# Altium project PrintNC_GRBLHAL_Breakout.PrjPCB (part 1 of 2)
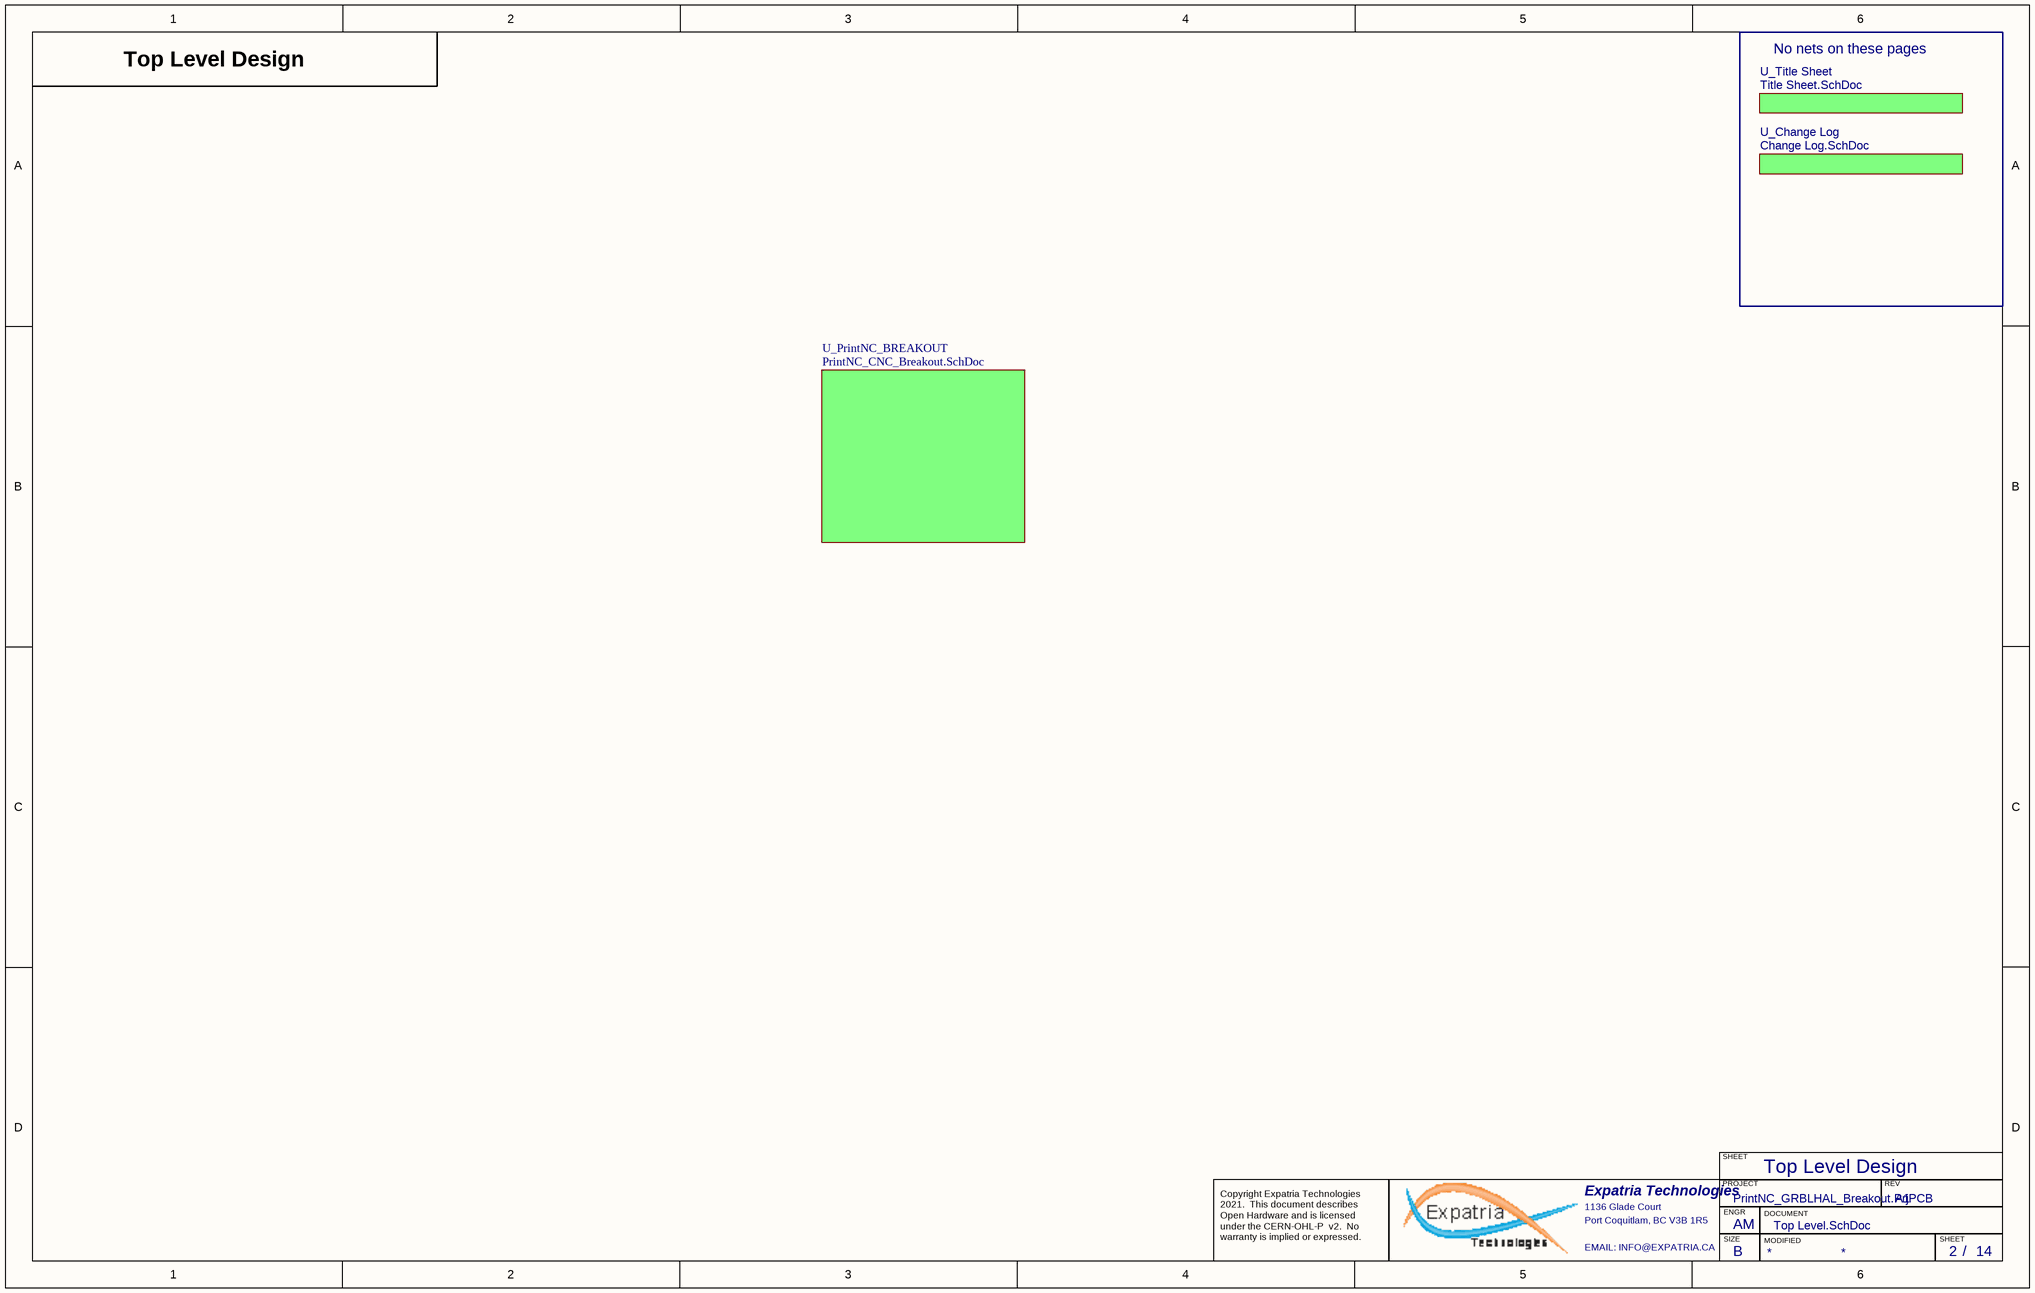
[diagram p0: Top Level.SchDoc]
PCBPARTNO: GRBLHAL_2000_EST; PCBREVNO: A8; Title: GRBLHAL_2000_EST; VarRevNo: A8
15 sheets, 297 parts. Net scope: hierarchical (ports join the sheet entries above them; power ports are global).
Board file: PrintNC_GRBLHAL_Breakout.pcbdoc
Sheets:
  Top Level.SchDoc
    U_Title Sheet = Title Sheet.SchDoc
    U_Change Log = Change Log.SchDoc
    U_PrintNC_BREAKOUT = PrintNC_CNC_Breakout.SchDoc
      LIM_SW = Limit_Switches.SchDoc
        LS_X = 1x_limit_switch.SchDoc
        LS_Y = 1x_limit_switch.SchDoc
        LS_Z = 1x_limit_switch.SchDoc
        LS_A = 1x_limit_switch.SchDoc
        LS_B = 2xparallelswitch.SchDoc
      USR_SW = Misc_switches.SchDoc
        PH_DR = Photocoupler12Vinput.SchDoc
        PH_CY = Photocoupler12Vinput.SchDoc
        PH_FD = Photocoupler12Vinput.SchDoc
        PH_HLT = Photocoupler12Vinput.SchDoc
        PH_PR = 2xparallelswitch.SchDoc
      STP_X = Stepper_driver.SchDoc
      SPINDLE = Spindle_Control.SchDoc
      STP_Y = Stepper_driver.SchDoc
      STP_Z = Stepper_driver.SchDoc
      STP_A = Stepper_driver.SchDoc
      STP_B = Stepper_driver.SchDoc
      5V_Supply = 5V_Power_Supply.SchDoc
      EXT_KEYPAD = I2C_Keypad.SchDoc
      SPINDLE_SYNC = Spindle_Sync.SchDoc
      MODBUS = RS485.SchDoc

## Sheet Top Level.SchDoc: GRBLHAL_2000_EST
size B; PCB_Rev: A8; Author: AM; CompanyName: Expatria Technologies; DrawnBy: A.Marles; Engineer: AM; Organization: Expatria Technologies; Address1: 1136 Glade Court; Address2: Port Coquitlam, BC V3B 1R5; Address3: CANADA; DocumentNumber: 2; Revision: A1; SheetNumber: 2; SheetTotal: 14

### Sub-sheets
U_Change Log = Change Log.SchDoc: no entries
U_PrintNC_BREAKOUT = PrintNC_CNC_Breakout.SchDoc: no entries
U_Title Sheet = Title Sheet.SchDoc: no entries

### Notes on the sheet
- Top Level Design
- No nets on these pages
- SHEET
- Expatria Technologies
- 1136 Glade Court
- Port Coquitlam, BC V3B 1R5
- PROJECT
- SIZE
- ENGR
- MODIFIED
- DOCUMENT
- REV
- Copyright Expatria Technologies 2021.  This document describes Open Hardware and is licensed under the CERN-OHL-P  v2.  No warranty is implied or expressed.
- EMAIL: INFO@EXPATRIA.CA
- B
- /

## Sheet Title Sheet.SchDoc: GRBLHAL_2000_EST
size B; Author: AM; CompanyName: Expatria Technologies; DrawnBy: A.Marles; Engineer: AM; Organization: Expatria Technologies; Address1: Schematic; Address2: 101 Main Street, 14th Floor; Address3: Cambridge, MA 02142; Address4: USA; DocumentNumber: 1; Revision: A8; SheetNumber: 1; SheetTotal: 14; PCB_Rev: A1
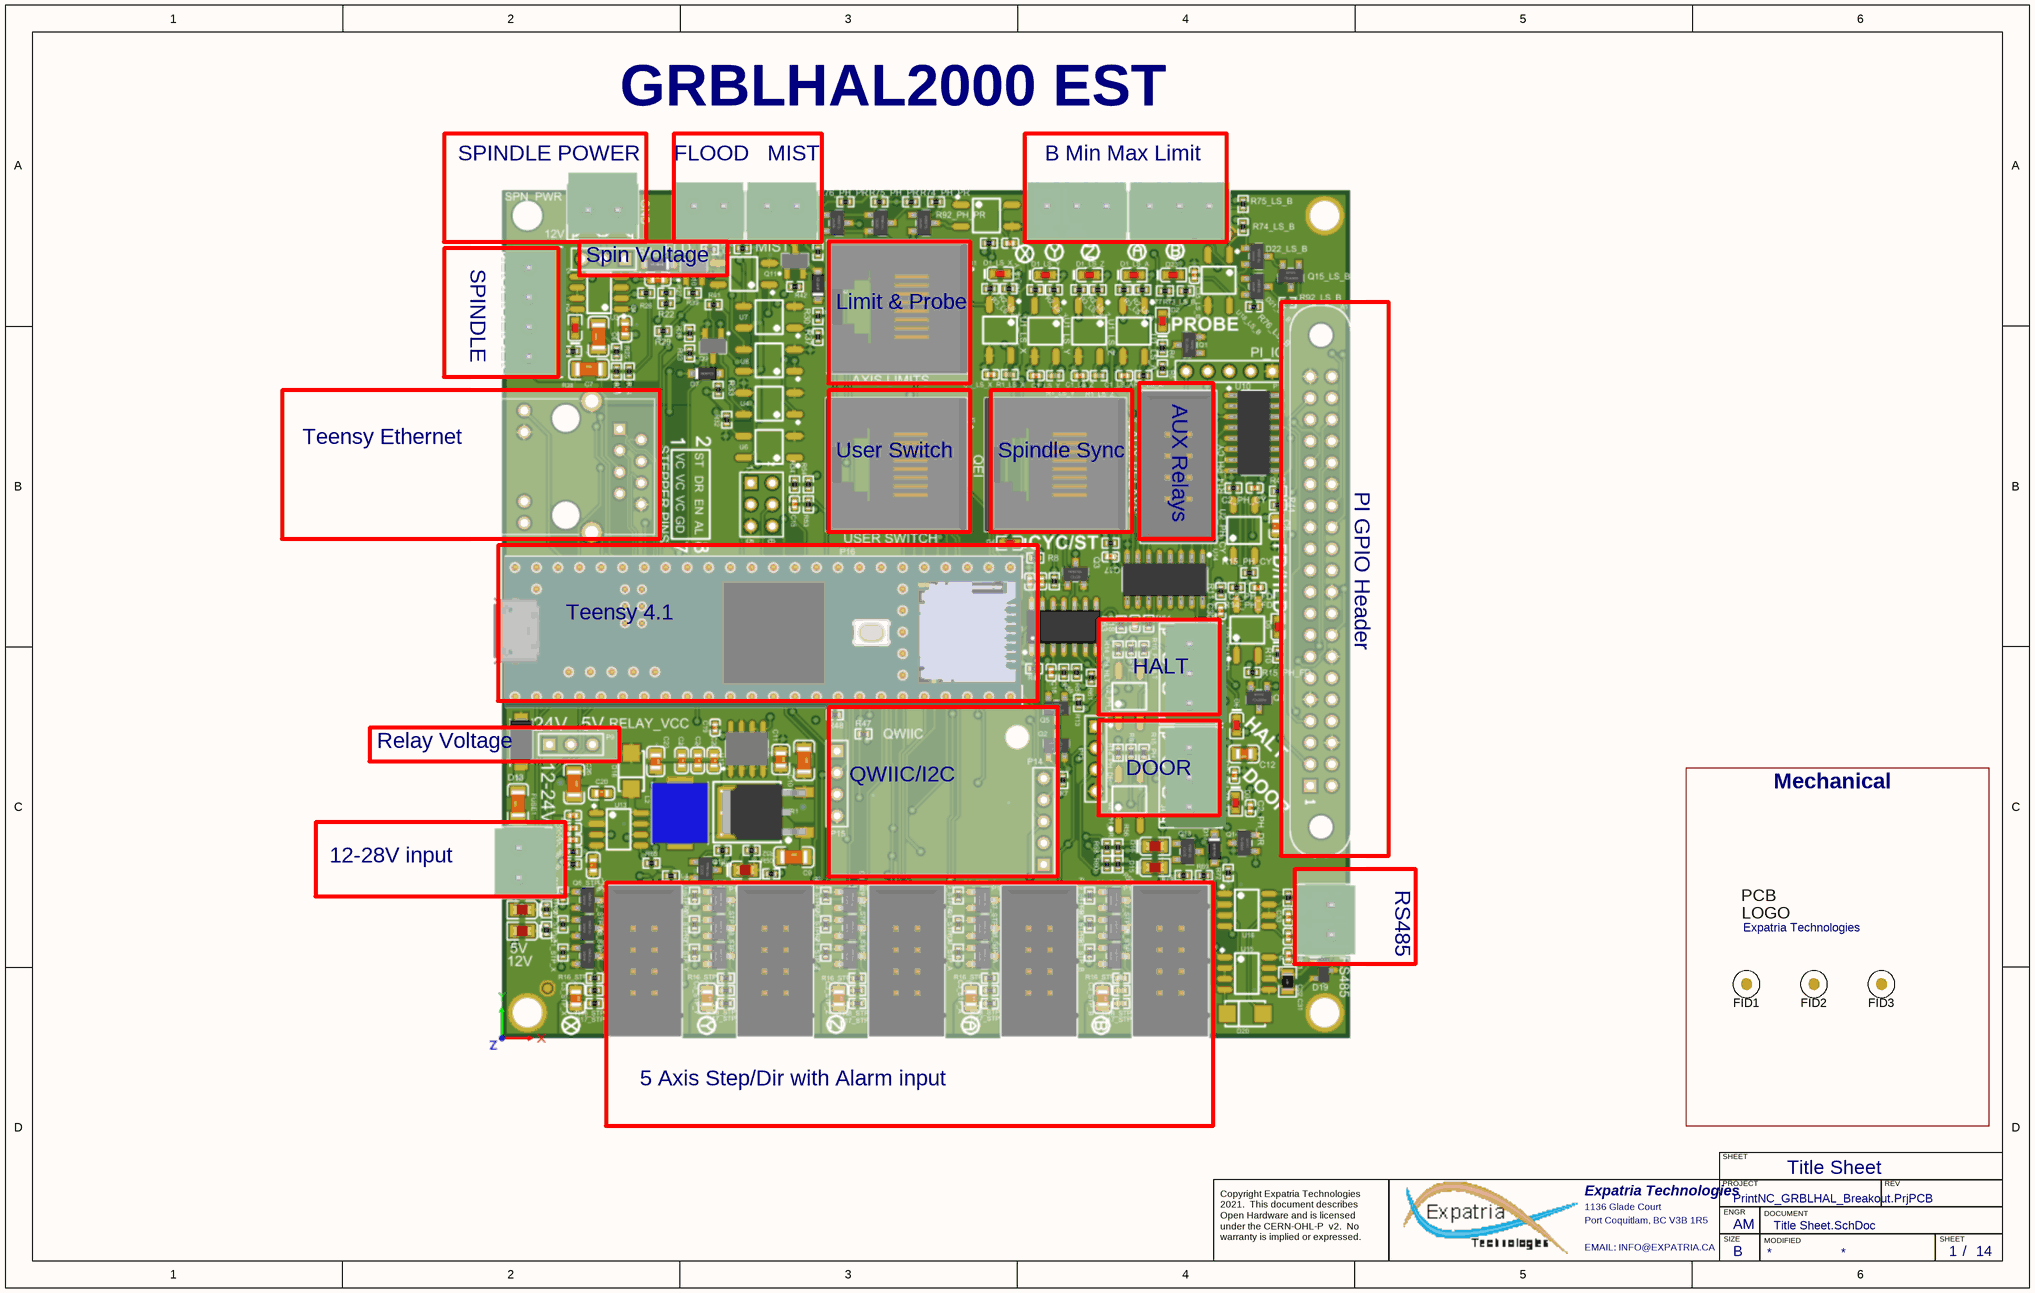
[diagram p1: Title Sheet.SchDoc]

### Parts
FID1  (no value)  [Fiducial10-20]  (no BOM)
FID2  Fiducial  [Fiducial10-20]  (value not drawn)  (no BOM)
FID3  Fiducial  [Fiducial10-20]  (value not drawn)  (no BOM)
Logo1  Expatria Technologies  [Expatria-Logo]  (no BOM)

### Blocks framed on the sheet
Mechanical: FID1-FID3 Logo1

### Notes on the sheet
- SPINDLE POWER
- GRBLHAL2000 EST
- FLOOD   MIST
- B Min Max Limit
- SPINDLE
- Spin Voltage
- Limit & Probe
- AUX Relays
- Teensy Ethernet
- User Switch
- Spindle Sync
- PI GPIO Header
- Teensy 4.1
- HALT
- Relay Voltage
- DOOR
- QWIIC/I2C
- 12-28V input
- RS485
- 5 Axis Step/Dir with Alarm input
- Title Sheet
- SHEET
- Expatria Technologies
- 1136 Glade Court
- Port Coquitlam, BC V3B 1R5
- PROJECT
- SIZE
- ENGR
- MODIFIED
- DOCUMENT
- REV
- Copyright Expatria Technologies 2021.  This document describes Open Hardware and is licensed under the CERN-OHL-P  v2.  No warranty is implied or expressed.
- EMAIL: INFO@EXPATRIA.CA
- B
- /
- (in symbol SBT-Logo) PCB; LOGO

### Library data of the parts
FID1-FID3 = Fiducial: FIDUCIAL NO ASSEMBLY; Manufacturer 1: NONE; Manufacturer Part Number 1: NONE; Value: Fiducial
Logo1 = SBT-Logo: Manufacturer 1: NONE; Value: Expatria Logo; Manufacturer Part Number 1: NONE

## Sheet Change Log.SchDoc: GRBLHAL_2000_EST
size B; Author: AM; CompanyName: Expatria Technologies; DrawnBy: A.Marles; Engineer: AM; Organization: Expatria Technologies; Address1: Schematic; Address2: 101 Main Street, 14th Floor; Address3: Cambridge, MA 02142; Address4: USA; DocumentNumber: 14; Revision: A8; SheetNumber: 14; SheetTotal: 14; PCB_Rev: A1
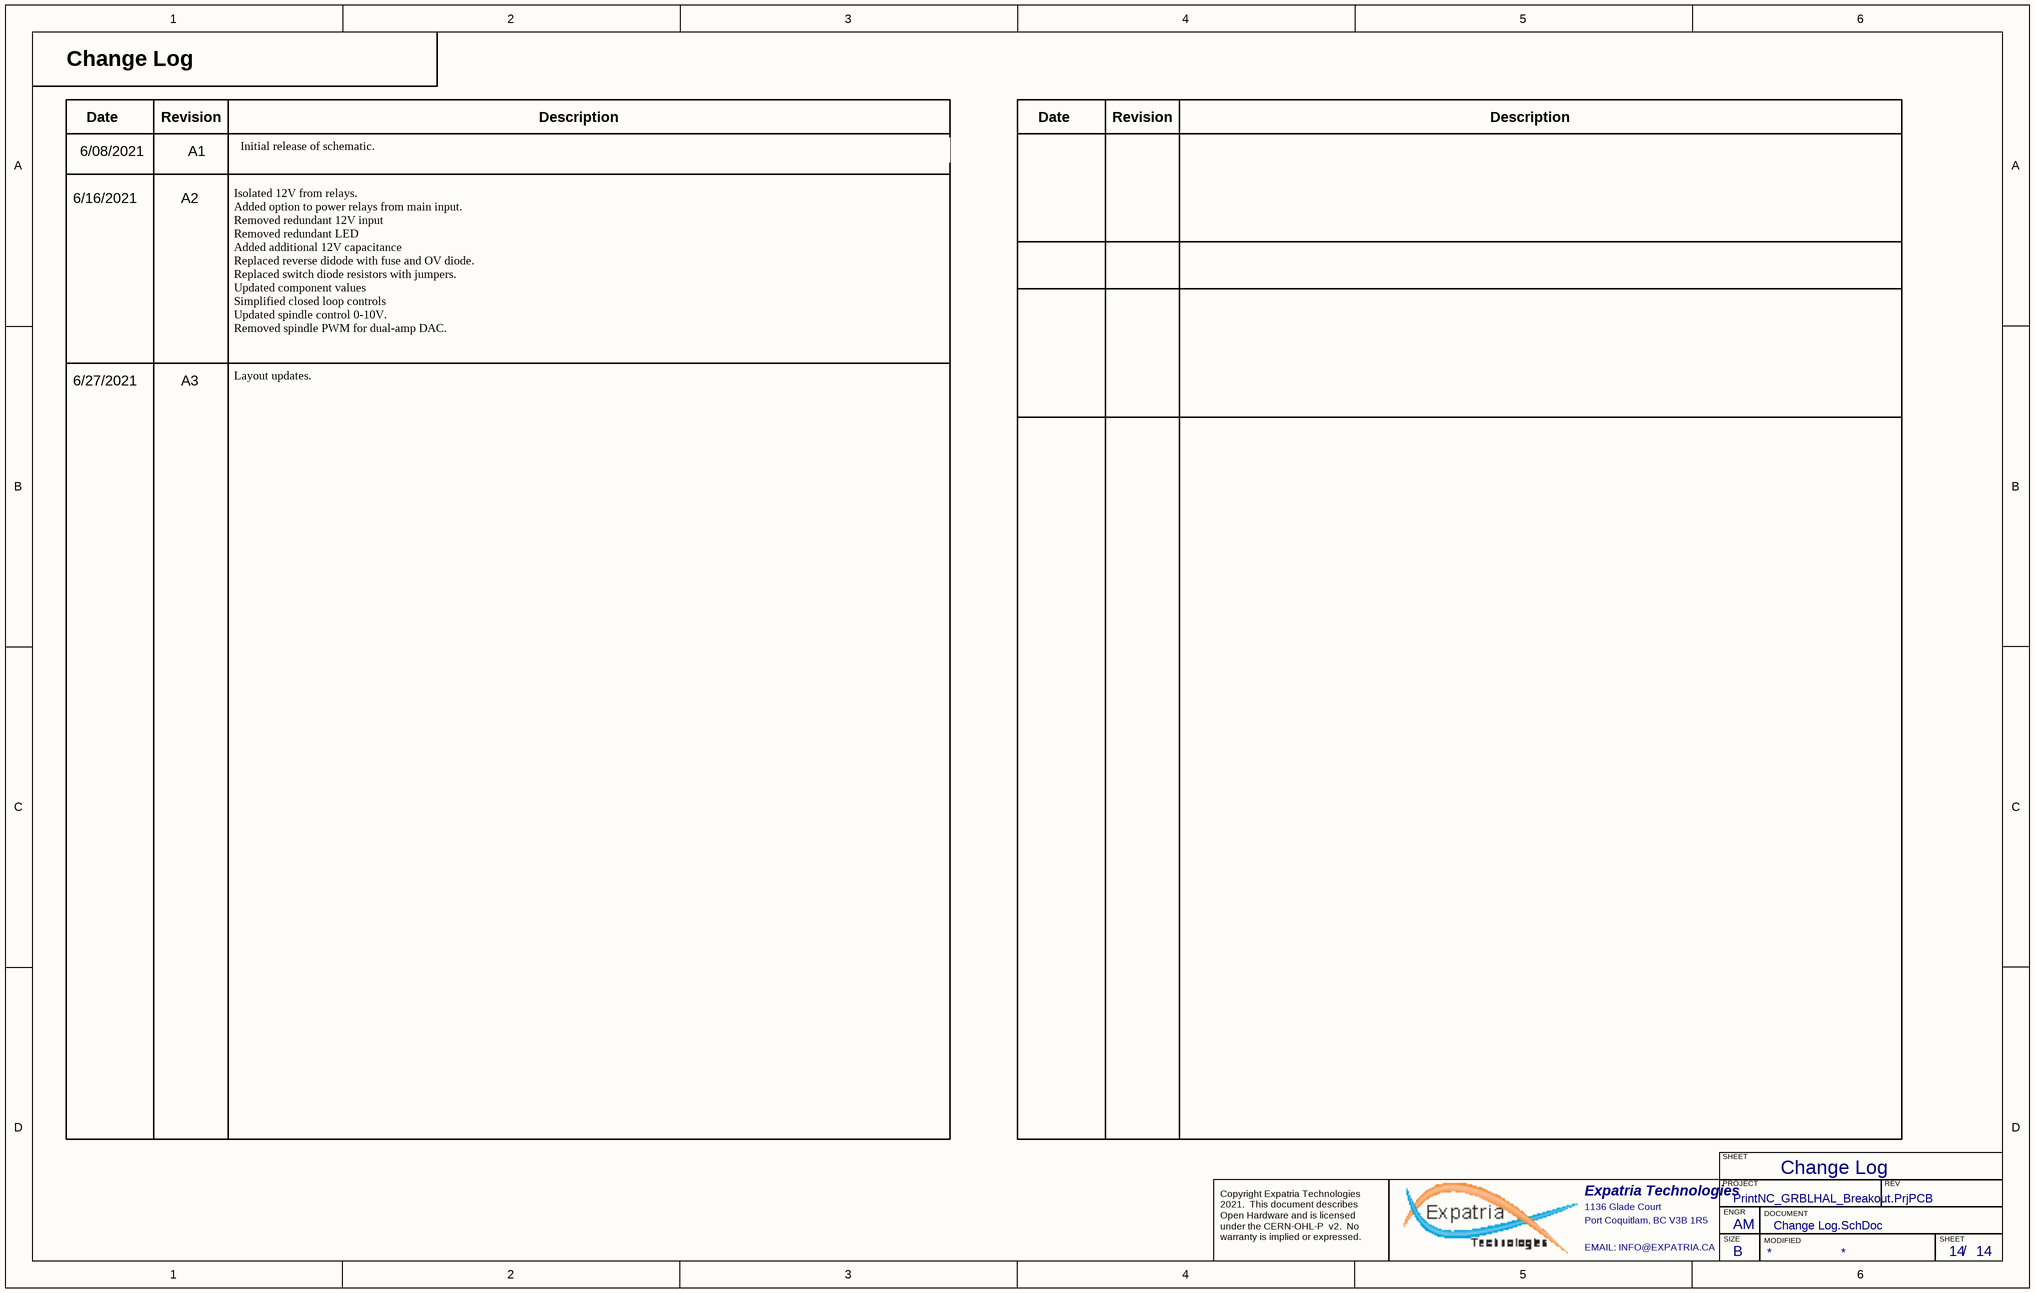
[diagram p2: Change Log.SchDoc]

### Notes on the sheet
- Change Log
- 6/08/2021
- Date
- Revision
- A1
- Initial release of schematic.
- Description
- 6/16/2021
- A2
- Isolated 12V from relays.
  Added option to power relays from main input.
  Removed redundant 12V input
  Removed redundant LED
  Added additional 12V capacitance
  Replaced reverse didode with fuse and OV diode.
  Replaced switch diode resistors with jumpers.
  Updated component values
  Simplified closed loop controls
  Updated spindle control 0-10V.
  Removed spindle PWM for dual-amp DAC.
- 6/27/2021
- A3
- Layout updates.
- SHEET
- Expatria Technologies
- 1136 Glade Court
- Port Coquitlam, BC V3B 1R5
- PROJECT
- SIZE
- ENGR
- MODIFIED
- DOCUMENT
- REV
- Copyright Expatria Technologies 2021.  This document describes Open Hardware and is licensed under the CERN-OHL-P  v2.  No warranty is implied or expressed.
- EMAIL: INFO@EXPATRIA.CA
- B
- /

## Sheet PrintNC_CNC_Breakout.SchDoc: GRBLHAL_2000_EST
size C; Author: AM; CompanyName: Expatria Technologies; DrawnBy: A.Marles; Engineer: AM; Organization: Expatria Technologies; Address1: Schematic; Address2: 101 Main Street, 14th Floor; Address3: Cambridge, MA 02142; Address4: USA; DocumentNumber: 3; Revision: A8; SheetNumber: 3; SheetTotal: 14; PCB_Rev: A1
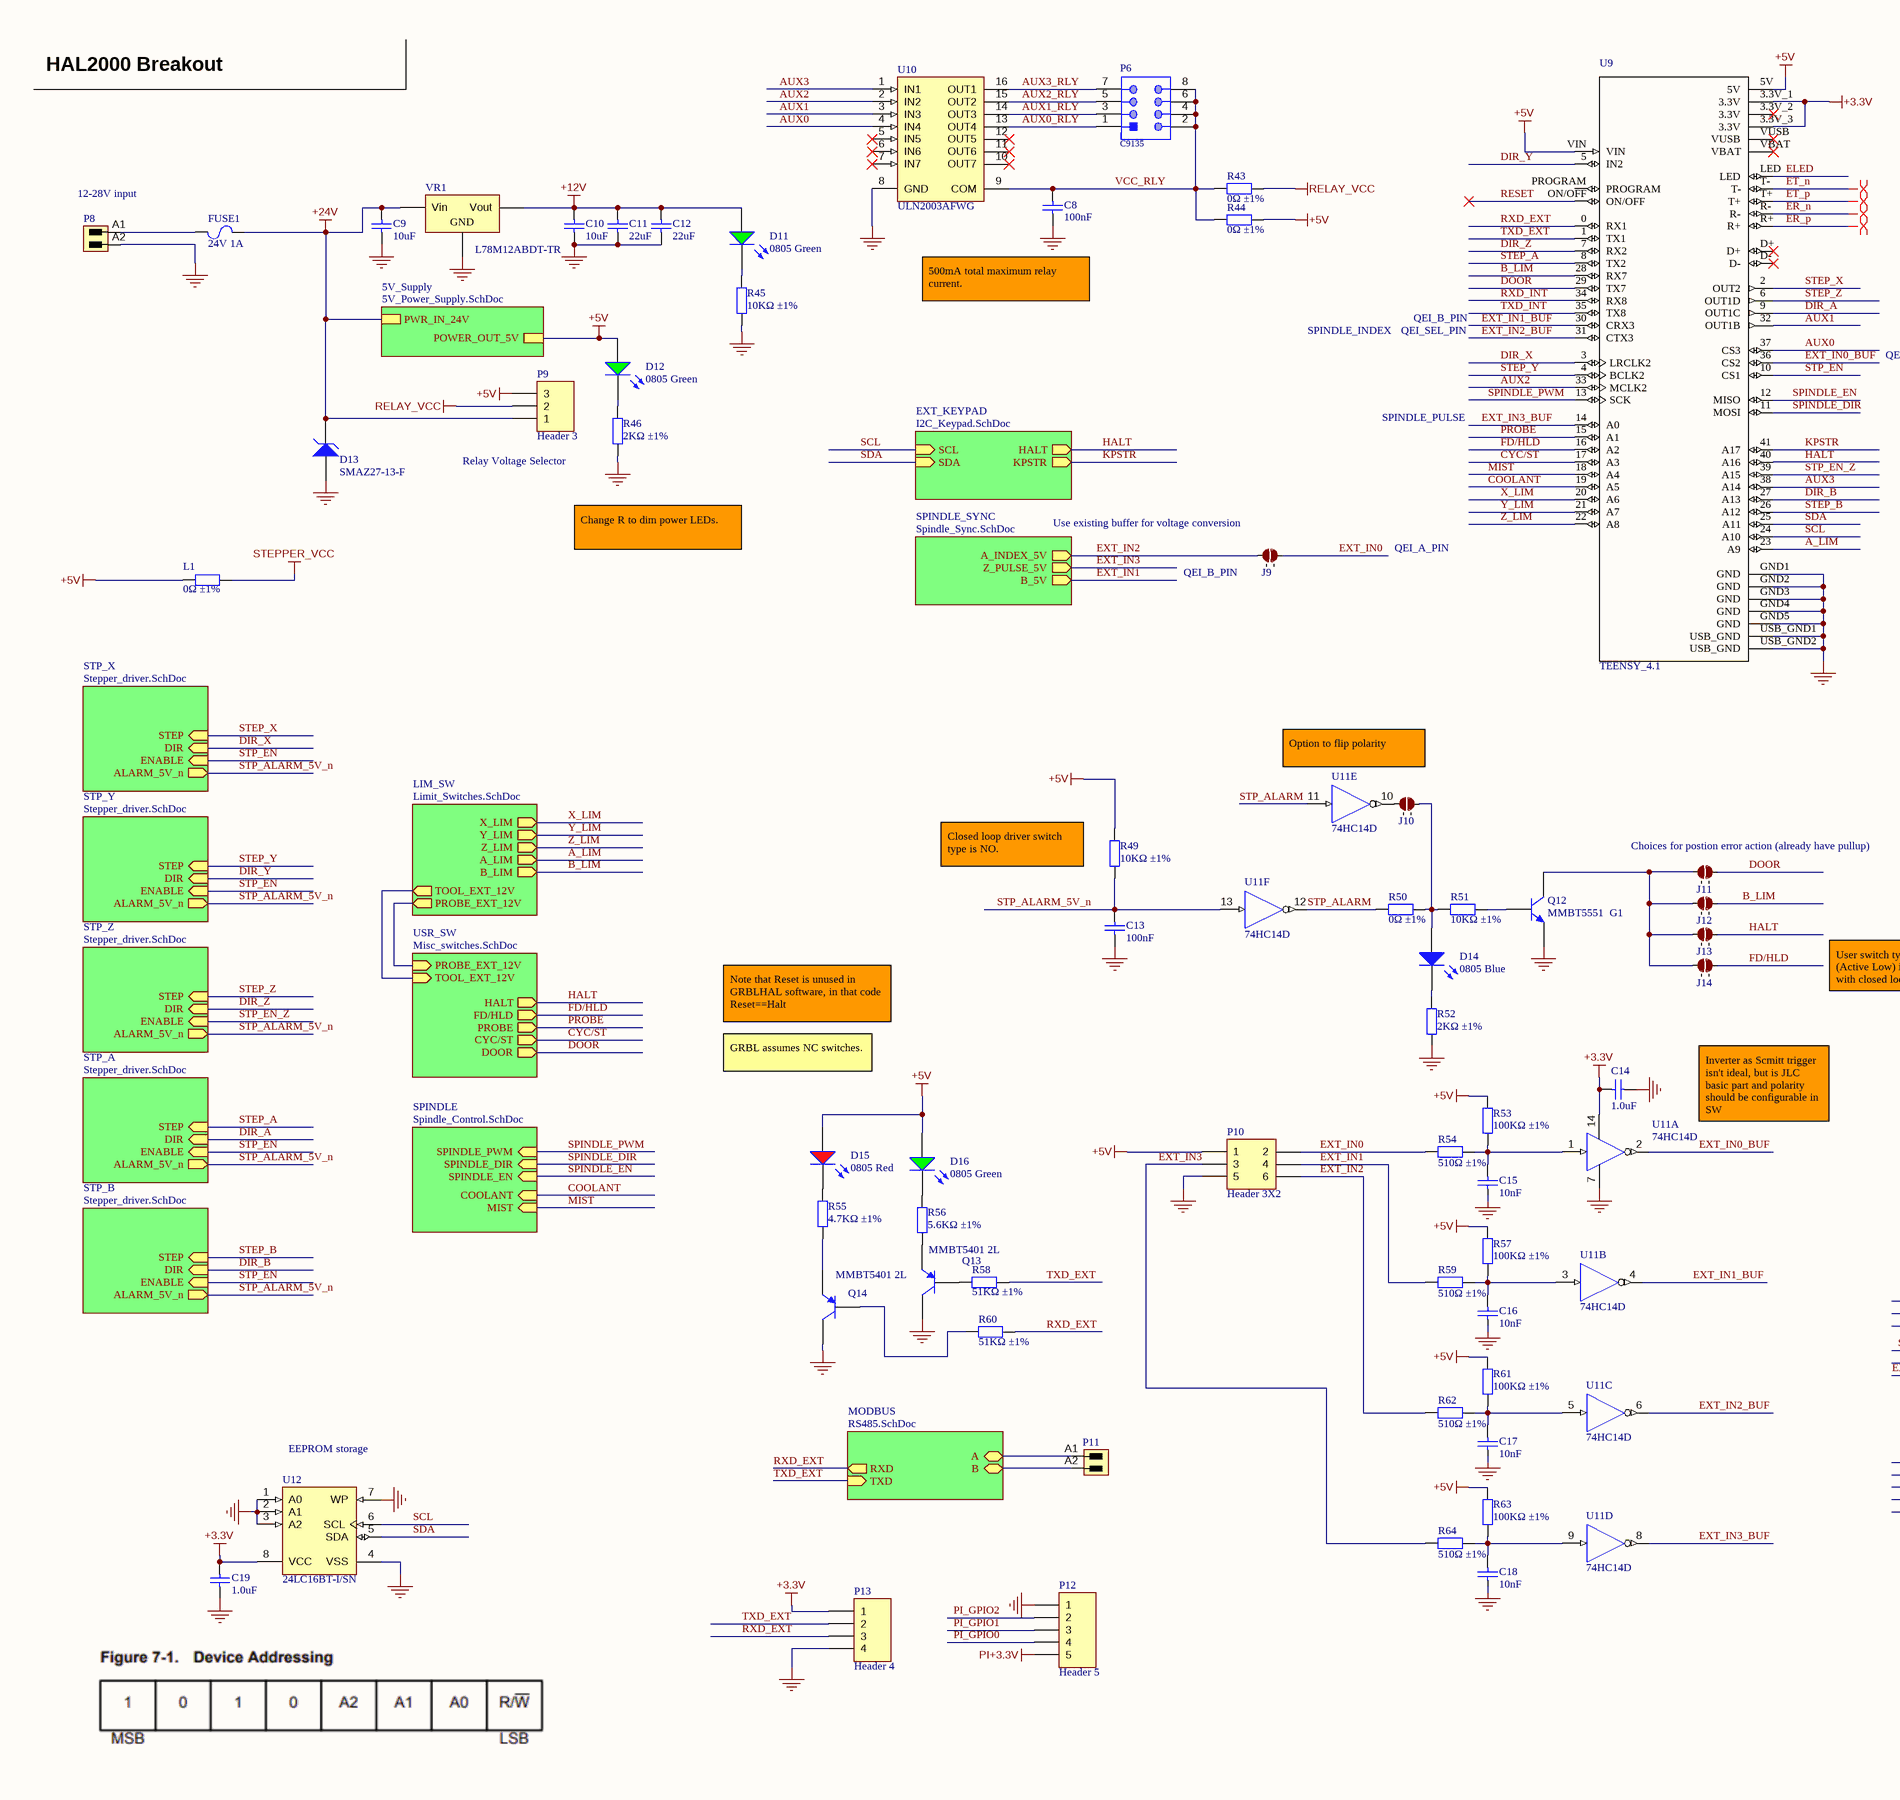
[diagram p3: PrintNC_CNC_Breakout.SchDoc, left]
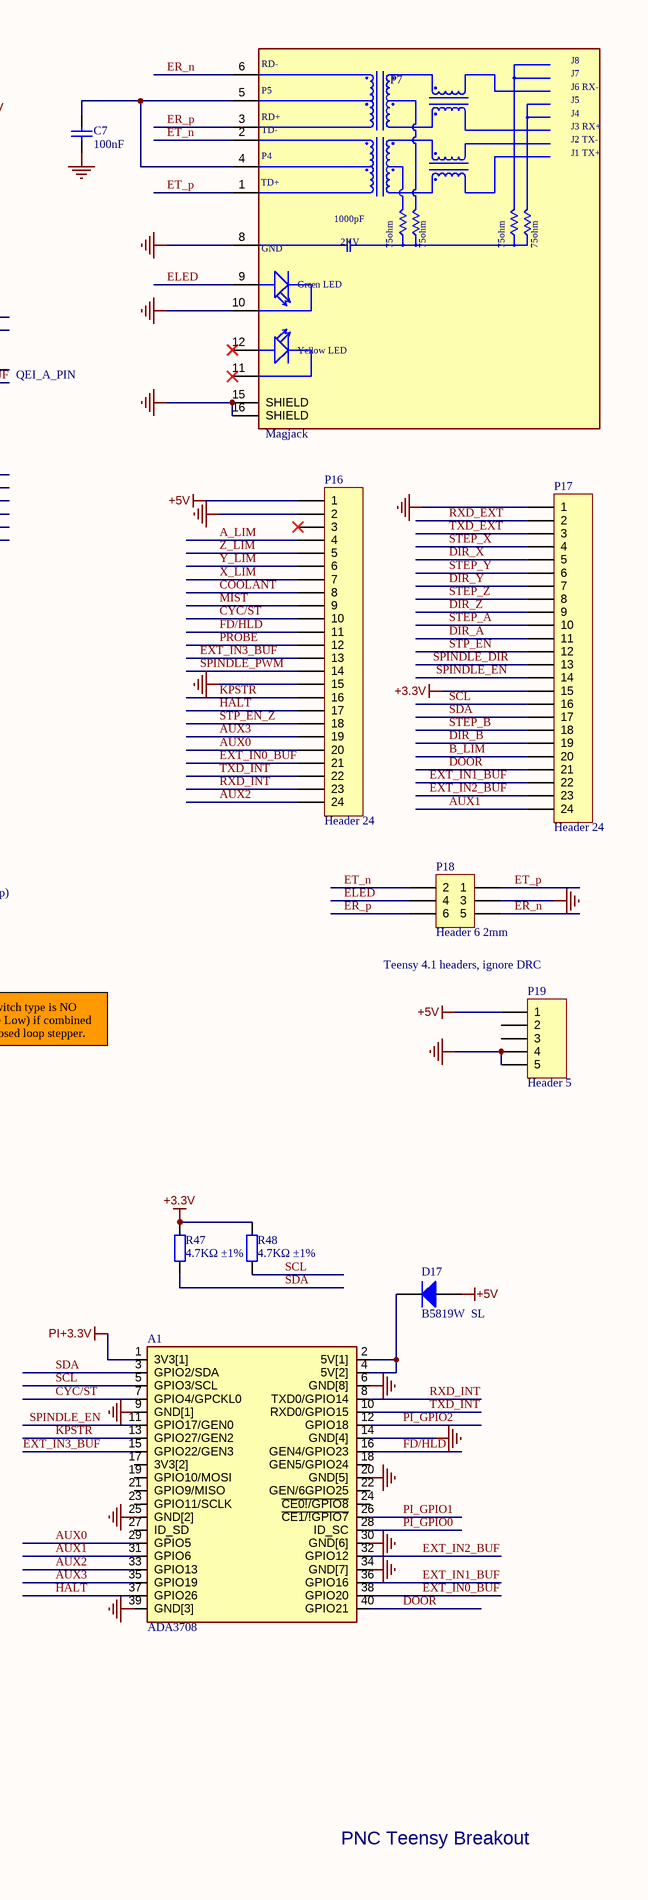
[diagram p4: PrintNC_CNC_Breakout.SchDoc, right]

### Parts
A1  ADA3708  [ADA3708_RPI-ZERO]
C7  100nF  [1206_C]
C8  100nF  [0603_C]
C9  10uF  [1206_C]
C10  10uF  [1206_C]
C11  22uF  [0805_C]
C12  22uF  [0805_C]
C13  100nF  [0402_C]
C14  1.0uF  [0402_C]
C15  10nF  [0402_C]
C16  10nF  [0402_C]
C17  10nF  [0402_C]
C18  10nF  [0402_C]
C19  1.0uF  [0402_C]
D11  0805 Green  [0805_LED_S1]
D12  0805 Green  [0805_LED_S1]
D13  SMAZ27-13-F  [DIOM5226X240N]
D14  0805 Blue  [0805_LED_S1]
D15  0805 Red  [0805_LED_S1]
D16  0805 Green  [0805_LED_S1]
D17  B5819W  SL  [SOD-123]
FUSE1  24V 1A  [1206_C]
J9  2 way net solder junction - Normally Open  [2waySolder_NO]  (value not drawn)  (no BOM)
J10  2 way net solder junction - Normally Open  [2waySolder_NO]  (value not drawn)  (no BOM)
J11  2 way net solder junction - Normally Open  [2waySolder_NO]  (value not drawn)  (no BOM)
J12  2 way net solder junction - Normally Open  [2waySolder_NO]  (value not drawn)  (no BOM)
J13  2 way net solder junction - Normally Open  [2waySolder_NO]  (value not drawn)  (no BOM)
J14  2 way net solder junction - Normally Open  [2waySolder_NO]  (value not drawn)  (no BOM)
L1  0Ω ±1%  [0402_R]
P6  C9135  [61200821621]
P7  Magjack  [HANRUN_HR911105A]
P8  (no value)  [SL_3_50_180G_02]
P9  Header 3  [HDR1X3]
P10  Header 3X2  [HDR2X3]
P11  (no value)  [SL_3_50_180G_02]
P12  Header 5  [HDR1X5]
P13  Header 4  [HDR1X4]  (no BOM)
P16  Header 24  [HDR1X24]  (no BOM)
P17  Header 24  [HDR1X24]  (no BOM)
P18  Header 6 2mm  [HDR2X3 - 2mm]
P19  Header 5  [HDR1X5]  (no BOM)
Q12  MMBT5551  G1  [SOT-23(SOT-23-3)]
Q13  MMBT5401 2L  [SOT-23(SOT-23-3)]
Q14  MMBT5401 2L  [SOT-23(SOT-23-3)]
R43  0Ω ±1%  [0402_R]
R44  0Ω ±1%  [0402_R]  (no BOM)
R45  10KΩ ±1%  [0402_R]
R46  2KΩ ±1%  [0402_R]
R47  4.7KΩ ±1%  [0402_R]
R48  4.7KΩ ±1%  [0402_R]
R49  10KΩ ±1%  [0402_R]
R50  0Ω ±1%  [0402_R]
R51  10KΩ ±1%  [0402_R]
R52  2KΩ ±1%  [0402_R]
R53  100KΩ ±1%  [0402_R]
R54  510Ω ±1%  [0402_R]
R55  4.7KΩ ±1%  [0402_R]
R56  5.6KΩ ±1%  [0402_R]
R57  100KΩ ±1%  [0402_R]
R58  51KΩ ±1%  [0402_R]
R59  510Ω ±1%  [0402_R]
R60  51KΩ ±1%  [0402_R]
R61  100KΩ ±1%  [0402_R]
R62  510Ω ±1%  [0402_R]
R63  100KΩ ±1%  [0402_R]
R64  510Ω ±1%  [0402_R]
U9  TEENSY_4.1  [TEENSY4-1]  (no BOM)
U10  ULN2003AFWG  [SOIC-16_150mil]
U11  74HC14D  [SOIC-14_150mil]  (parts A,B,C,D,E,F of 6)
U12  24LC16BT-I/SN  [SOIC-SN8_L]
VR1  L78M12ABDT-TR  [TO-252-2-180]

### Sub-sheets
5V_Supply = 5V_Power_Supply.SchDoc: POWER_OUT_5V, PWR_IN_24V
EXT_KEYPAD = I2C_Keypad.SchDoc: HALT (out), SCL (in), KPSTR (out), SDA (in)
LIM_SW = Limit_Switches.SchDoc: Y_LIM (out), Z_LIM (out), X_LIM (out), A_LIM (out), B_LIM (out), TOOL_EXT_12V (out), PROBE_EXT_12V (out)
MODBUS = RS485.SchDoc: A (bidir), B (bidir), RXD (out), TXD (in)
SPINDLE = Spindle_Control.SchDoc: SPINDLE_DIR (in), COOLANT (in), SPINDLE_PWM (in), SPINDLE_EN (in), MIST (in)
SPINDLE_SYNC = Spindle_Sync.SchDoc: Z_PULSE_5V (out), A_INDEX_5V (out), B_5V (out)
STP_A = Stepper_driver.SchDoc: ALARM_5V_n (out), STEP (in), DIR (in), ENABLE (in)
STP_B = Stepper_driver.SchDoc: STEP (in), DIR (in), ENABLE (in), ALARM_5V_n (out)
STP_X = Stepper_driver.SchDoc: ALARM_5V_n (out), STEP (in), DIR (in), ENABLE (in)
STP_Y = Stepper_driver.SchDoc: ALARM_5V_n (out), STEP (in), DIR (in), ENABLE (in)
STP_Z = Stepper_driver.SchDoc: ALARM_5V_n (out), STEP (in), DIR (in), ENABLE (in)
USR_SW = Misc_switches.SchDoc: HALT (out), FD/HLD (out), PROBE (out), CYC/ST (out), DOOR (out), TOOL_EXT_12V (in), PROBE_EXT_12V (in)

### Nets
+3.3V: C14.1 C19.2 P13.1 P17.15 R47.2 R48.2 U9.3.3V_1(3.3V) U9.3.3V_3(3.3V) U11.14(VDD) U12.8(VCC)
+5V: D12.A D15.A D16.A D17.1(A) L1.1 P9.3 P10.1 P16.1 P19.1 R44.1 R49.2 R53.2 R57.2 R61.2 R63.2 U9.5V U9.VIN ; sheet 5V_Supply/POWER_OUT_5V
+12V: C10.2 C11.2 C12.2 D11.A VR1.3(Vout)
+24V: C9.2 D13.2(K) FUSE1.2 P9.1 VR1.1(Vin) ; sheet 5V_Supply/PWR_IN_24V
GND: A1.6(GND[8]) A1.9(GND[1]) A1.14(GND[4]) A1.20(GND[5]) A1.25(GND[2]) A1.30(GND[6]) A1.34(GND[7]) A1.39(GND[3]) C7.1 C8.1 C9.1 C10.1 C11.1 C12.1 C13.1 C14.2 C15.1 C16.1 C17.1 C18.1 C19.1 D13.1(A) P7.8(GND) P7.10(GC) P7.15(SHIELD) P7.16(SHIELD) P8.A2 P10.5 P12.1 P13.4 P16.2 P16.15 P17.1 P18.3 P19.4 P19.5 Q12.2(E) Q13.3(C) Q14.3(C) R45.1 R46.1 R52.1 U9.GND1(GND) U9.GND2(GND) U9.GND3(GND) U9.GND4(GND) U9.GND5(GND) U9.USB_GND1(USB_GND) U9.USB_GND2(USB_GND) U10.8(GND) U11.7(GND) U12.1(A0) U12.2(A1) U12.3(A2) U12.4(VSS) U12.7(WP) VR1.2(GND)
PI+3.3V: A1.1(3V3[1]) P12.5
RELAY_VCC: P9.2 R43.1
STEPPER_VCC: L1.2
A: P11.A1 ; sheet MODBUS/A
A_LIM: P16.4 U9.23(A9) ; sheet LIM_SW/A_LIM
AUX0: A1.29(GPIO5) P16.20 U9.37(CS3) U10.4(IN4)
AUX0_RLY: P6.1 U10.13(OUT4)
AUX1: A1.31(GPIO6) P17.24 U9.32(OUT1B) U10.3(IN3)
AUX1_RLY: P6.3 U10.14(OUT3)
AUX2: A1.33(GPIO13) P16.24 U9.33(MCLK2) U10.2(IN2)
AUX2_RLY: P6.5 U10.15(OUT2)
AUX3: A1.35(GPIO19) P16.19 U9.38(A14) U10.1(IN1)
AUX3_RLY: P6.7 U10.16(OUT1)
B: P11.A2 ; sheet MODBUS/B
B_LIM: J12.2 P17.20 U9.28(RX7) ; sheet LIM_SW/B_LIM
COOLANT: P16.8 U9.19(A5) ; sheet SPINDLE/COOLANT
CYC/ST: A1.7(GPIO4/GPCKL0) P16.10 U9.17(A3) ; sheet USR_SW/CYC/ST
DIR_A: P17.11 U9.9(OUT1C) ; sheet STP_A/DIR
DIR_B: P17.19 U9.27(A13) ; sheet STP_B/DIR
DIR_X: P17.5 U9.3(LRCLK2) ; sheet STP_X/DIR
DIR_Y: P17.7 U9.5(IN2) ; sheet STP_Y/DIR
DIR_Z: P17.9 U9.7(RX2) ; sheet STP_Z/DIR
DOOR: A1.40(GPIO21) J11.2 P17.21 U9.29(TX7) ; sheet USR_SW/DOOR
ELED: P7.9(GA) P18.4 U9.LED
ER_n: P7.6(RD-) P18.5 U9.R-
ER_p: P7.3(RD+) P18.6 U9.R+
ET_n: P7.2(TD-) P18.2 U9.T-
ET_p: P7.1(TD+) P18.1 U9.T+
EXT_IN0: J9.2 P10.2 R54.1
EXT_IN0_BUF: A1.38(GPIO20) P16.21 U9.36(CS2) U11.2(Y)
EXT_IN1: P10.4 R59.1 ; sheet SPINDLE_SYNC/B_5V
EXT_IN1_BUF: A1.36(GPIO16) P17.22 U9.30(CRX3) U11.4(Y)
EXT_IN2: J9.1 P10.6 R62.1 ; sheet SPINDLE_SYNC/A_INDEX_5V
EXT_IN2_BUF: A1.32(GPIO12) P17.23 U9.31(CTX3) U11.6(Y)
EXT_IN3: P10.3 R64.1 ; sheet SPINDLE_SYNC/Z_PULSE_5V
EXT_IN3_BUF: A1.15(GPIO22/GEN3) P16.13 U9.14(A0) U11.8(Y)
FD/HLD: A1.16(GEN4/GPIO23) J14.2 P16.11 U9.16(A2) ; sheet USR_SW/FD/HLD
HALT: A1.37(GPIO26) J13.2 P16.17 U9.40(A16) ; sheet USR_SW/HALT, sheet EXT_KEYPAD/HALT
KPSTR: A1.13(GPIO27/GEN2) P16.16 U9.41(A17) ; sheet EXT_KEYPAD/KPSTR
MAXLIM: sheet LIM_SW/PROBE_EXT_12V, sheet USR_SW/PROBE_EXT_12V
MINLIM: sheet LIM_SW/TOOL_EXT_12V, sheet USR_SW/TOOL_EXT_12V
MIST: P16.9 U9.18(A4) ; sheet SPINDLE/MIST
PI_GPIO0: A1.28(ID_SC) P12.4
PI_GPIO1: A1.26(~{CE1/!GPIO7}) P12.3
PI_GPIO2: A1.12(GPIO18) P12.2
PROBE: P16.12 U9.15(A1) ; sheet USR_SW/PROBE
RESET: U9.ON/OFF
RXD_EXT: P13.3 P17.2 R60.1 U9.0(RX1) ; sheet MODBUS/RXD
RXD_INT: A1.8(TXD0/GPIO14) P16.23 U9.34(RX8)
SCL: A1.5(GPIO3/SCL) P17.16 R48.1 U9.24(A10) U12.6(SCL) ; sheet EXT_KEYPAD/SCL
SDA: A1.3(GPIO2/SDA) P17.17 R47.1 U9.25(A11) U12.5(SDA) ; sheet EXT_KEYPAD/SDA
SPINDLE_DIR: P17.13 U9.11(MOSI) ; sheet SPINDLE/SPINDLE_DIR
SPINDLE_EN: A1.11(GPIO17/GEN0) P17.14 U9.12(MISO) ; sheet SPINDLE/SPINDLE_EN
SPINDLE_PWM: P16.14 U9.13(SCK) ; sheet SPINDLE/SPINDLE_PWM
STEP_A: P17.10 U9.8(TX2) ; sheet STP_A/STEP
STEP_B: P17.18 U9.26(A12) ; sheet STP_B/STEP
STEP_X: P17.4 U9.2(OUT2) ; sheet STP_X/STEP
STEP_Y: P17.6 U9.4(BCLK2) ; sheet STP_Y/STEP
STEP_Z: P17.8 U9.6(OUT1D) ; sheet STP_Z/STEP
STP_ALARM: R50.2 U11.11(A) U11.12(Y)
STP_ALARM_5V_n: C13.2 R49.1 U11.13(A) ; sheet STP_X/ALARM_5V_n, sheet STP_Y/ALARM_5V_n, sheet STP_Z/ALARM_5V_n, sheet STP_A/ALARM_5V_n, sheet STP_B/ALARM_5V_n
STP_EN: P17.12 U9.10(CS1) ; sheet STP_X/ENABLE, sheet STP_Y/ENABLE, sheet STP_A/ENABLE, sheet STP_B/ENABLE
STP_EN_Z: P16.18 U9.39(A15) ; sheet STP_Z/ENABLE
TXD_EXT: P13.2 P17.3 R58.2 U9.1(TX1) ; sheet MODBUS/TXD
TXD_INT: A1.10(RXD0/GPIO15) P16.22 U9.35(TX8)
VCC_RLY: C8.2 P6.2 P6.4 P6.6 P6.8 R43.2 R44.2 U10.9(COM)
X_LIM: P16.7 U9.20(A6) ; sheet LIM_SW/X_LIM
Y_LIM: P16.6 U9.21(A7) ; sheet LIM_SW/Y_LIM
Z_LIM: P16.5 U9.22(A8) ; sheet LIM_SW/Z_LIM
NetA1_2: A1.2(5V[1]) A1.4(5V[2]) D17.2(K)
NetC7_2: C7.2 P7.4(P4) P7.5(P5)
NetC15_2: C15.2 R53.1 R54.2 U11.1(A)
NetC16_2: C16.2 R57.1 R59.2 U11.3(A)
NetC17_2: C17.2 R61.1 R62.2 U11.5(A)
NetC18_2: C18.2 R63.1 R64.2 U11.9(A)
NetD11_K: D11.K R45.2
NetD12_K: D12.K R46.2
NetD14_A: D14.A J10.2 R50.1 R51.1
NetD14_K: D14.K R52.2
NetD15_K: D15.K R55.2
NetD16_K: D16.K R56.2
NetFUSE1_1: FUSE1.1 P8.A1
NetJ10_1: J10.1 U11.10(Y)
NetJ11_1: J11.1 J12.1 J13.1 J14.1 Q12.3(C)
NetQ12_1: Q12.1(B) R51.2
NetQ13_1: Q13.1(B) R58.1
NetQ13_2: Q13.2(E) R56.1
NetQ14_1: Q14.1(B) R60.2
NetQ14_2: Q14.2(E) R55.1

Not connected (* = marked no-connect by the designer): A1 17(3V3[2]) 18(GEN5/GPIO24) 19(GPIO10/MOSI) 21(GPIO9/MISO) 22(GEN/6GPIO25) 23(GPIO11/SCLK) 24(~{CE0!/GPIO8}) 27(ID_SD); P7 11(YC)* 12(YA)*; P16 3*; P19 2 3; U9 3.3V_2(3.3V)* D+* D-* PROGRAM VBAT* VUSB*; U10 5(IN5)* 6(IN6)* 7(IN7)* 10(OUT7)* 11(OUT6)* 12(OUT5)*

### Layout directives
differential pair: ER_n, ER_p, ET_n, ET_p

### Notes on the sheet
- HAL2000 Breakout
- (near P8) 12-28V input
- 500mA total maximum relay current.
- SPINDLE_INDEX
- QEI_SEL_PIN
- QEI_B_PIN
- QEI_A_PIN
- SPINDLE_PULSE
- Relay Voltage Selector
- (near J9) Use existing buffer for voltage conversion
- Change R to dim power LEDs.
- (near J9) QEI_B_PIN
- Option to flip polarity
- (near R49) Closed loop driver switch type is NO.
- (near J11) Choices for postion error action (already have pullup)
- Teensy 4.1 headers, ignore DRC
- Note that Reset is unused in GRBLHAL software, in that code Reset==Halt
- User switch type is NO (Active Low) if combined with closed loop stepper.
- GRBL assumes NC switches.
- Inverter as Scmitt trigger isn't ideal, but is JLC basic part and polarity should be configurable in SW
- (near U12) EEPROM storage
- PNC Teensy Breakout
- Expatria Technologies
- SHEET
- PROJECT
- REV
- 1136 Glade Court
- Port Coquitlam, BC V3B 1R5
- EMAIL: INFO@EXPATRIA.CA
- SIZE
- ENGR
- C
- MODIFIED
- DOCUMENT
- /
- Copyright Expatria Technologies 2021.  This document describes Open Hardware and is licensed under the CERN-OHL-P  v2.  No warranty is implied or expressed.
- (in symbol HR911105A) J8; J7; J6 RX-; J5; J4; J3 RX+; J2 TX-; J1 TX+; 1000pF; 2KV; 75ohm; Green LED; Yellow LED

### Library data of the parts
A1 = ADA3708: Raspberry Pi Zero WH _Zero W with Headers_; MP: ADA3708; Availability: Unavailable; Package: None; MF: Raspberry Pi; Value: *; Price: None; SnapEDA_Link: https://www.snapeda.com/parts/ADA3708/Raspberry%20Pi/view-part/2770118/?ref=snap; SuppliersPartNumber: C429949
C7 = 1206 100nF (104) 10% 50V: Chip capacitors; Manufacturer: Samsung Electro-Mechanics; PartNumber: CL31B104KBCNNNC; Tolerance: 10%; Voltage: 50V; Package: 1206; Supplier: LC; SuppliersPartNumber: C24497; Capacitance: 100nF
C8 = 0603 100nF (104) 10% 50V: Chip capacitors; Manufacturer: YAGEO; PartNumber: CC0603KRX7R9BB104; Tolerance: 10%; Voltage: 50V; Package: 0603; Supplier: LC; SuppliersPartNumber: C14663; Capacitance: 100nF
C9 C10 = 1206 10uF (106) 10% 50V: Chip capacitors; Manufacturer: Samsung Electro-Mechanics; PartNumber: CL31A106KBHNNNE; Tolerance: 10%; Voltage: 50V; Package: 1206; Supplier: LC; SuppliersPartNumber: C13585; Capacitance: 10uF
C11 C12 = 0805 22uF (226) 20% 25V: Chip capacitors; Manufacturer: Samsung Electro-Mechanics; PartNumber: CL21A226MAQNNNE; Tolerance: 20%; Voltage: 25V; Package: 0805; Supplier: LC; SuppliersPartNumber: C45783; Capacitance: 22uF
C13 = 0402 100nF (104) 10% 16V: Chip capacitors; Manufacturer: Samsung Electro-Mechanics; PartNumber: CL05B104KO5NNNC; Tolerance: 10%; Voltage: 16V; Package: 0402; Supplier: LC; SuppliersPartNumber: C1525; Capacitance: 100nF
C14 C19 = 0402 1.0uF (105) 10% 25V: Chip capacitor; Manufacturer: Samsung Electro-Mechanics; PartNumber: CL05A105KA5NQNC; Capacitance: 1uF; Tolerance: 10%; Voltage: 25V; Package: 0402; Supplier: LC; SuppliersPartNumber: C52923
C15-C18 = 0402 10nF (103) 10% 50V: Chip capacitors; Manufacturer: Samsung Electro-Mechanics; PartNumber: CL05B103KB5NNNC; Tolerance: 10%; Voltage: 50V; Package: 0402; Supplier: LC; SuppliersPartNumber: C15195; Capacitance: 10nF
D11 D12 D16 = 0805 LED Green: LED; Package: 0805; Supplier: LC; SuppliersPartNumber: C2297; Color: Green
D13 = BZT52C27: 27V ±5% 1W 500nA @ 20.5V SMA(DO-214AC) Zener Diodes RoHS; Package: SMA(DO-214AC); Supplier: LC; SuppliersPartNumber: C155318
D14 = 0805 LED Blue: LED; Package: 0805; Supplier: LC; SuppliersPartNumber: C2293; Color: Blue
D15 = 0805 LED Red: LED; PartNumber: FC-2012HRK-620D; Manufacturer: Foshan NationStar Optoelectronics; Package: 0805; Supplier: LC; SuppliersPartNumber: C84256; Color: Red
D17 = SOD-123 B5819W  SL: 肖特基二极管; Package: SOD-123; Supplier: LC; SuppliersPartNumber: C8598
FUSE1 = JK-nSMD050-24: 24V 1A 0.1s 1206 PTC Resettable Fuses RoHS; Manufacturer: Jinrui Electronic Materials Co.; Package: 1206; Supplier: LC; SuppliersPartNumber: C369160; PartNumber: JK-nSMD050-24
J9-J14 = 2waySolderNO
L1 R43 R44 R50 = 0402 0R (0R0) 1%: Chip resistor; Manufacturer: Uniroyal Elec; PartNumber: 0402WGF0000TCE; Power: 1/16W; Package: 0402; Supplier: LC; SuppliersPartNumber: C17168; Resistance: 0Ω; Tolerance: 1%
P6 = CMP-1502-00006-1: Male Box Header WR-BHD, THT, Vertical, pitch 2.54 mm, 8 pins; Manufacturer: Wurth Elektronik; Pitch: 2.54mm; Publisher: WurthElektronik; Part Number: C9135; Packaging: Tray; Published Date: August2018; Package Reference: 61200821621; SuppliersPartNumber: C9135
P7 = HR911105A: HR911105A Ethernet Interface Arduino Platform Evaluation Expansion Board; MF: DFRobot; SuppliersPartNumber: C163507; Package: None; Availability: Unavailable; MP: HR911105A; Value: *; Price: None
P8 P11 = CMP-1559-00901-1: Header,Male Pin,Covered(4 Sided) 2 1 0.138"（3.50mm） 2 P=3.5mm Pluggable System Terminal Block RoHS; PartNumber: WJ15EDGVC-3.5-2P; Manufacturer: Ningbo Kangnex Elec; UL_94_flammability_rating: V-0; Pitch_mm: 3.5 mm; Side_termination_characteristic: closed side; Pitch_inch: 0.138 inch; Solder_pin_length_mm: 3.2 mm; Short_text_for_material: SL 3.50/02/180G 3.2SN OR BX; Revision: V1; PackageReference: SL_3_50_180G_02; Packaging: Box; SuppliersPartNumber: C192777
P9 = Header 3: Header, 3-Pin; Publisher: Altium Limited; SuppliersPartNumber: C49257
P10 = Header 3X2: Header, 3-Pin, Dual row; Publisher: Altium Limited; SuppliersPartNumber: C65114
P12 P19 = Header 5: Header, 5-Pin; LatestRevisionDate: 17-Jul-2002; LatestRevisionNote: Re-released for DXP Platform.; Publisher: Altium Limited; SuppliersPartNumber: C124379
P13 = Header 4: Header, 4-Pin; Publisher: Altium Limited; SuppliersPartNumber: C124378
P16 P17 = Header 24: Header, 24-Pin; LatestRevisionDate: 17-Jul-2002; LatestRevisionNote: Re-released for DXP Platform.; Publisher: Altium Limited; SuppliersPartNumber: C725956
P18 = Header 6 2mm: Header, 6-Pin 2x3, 2mm pitch; LatestRevisionDate: 17-Jul-2002; LatestRevisionNote: Re-released for DXP Platform.; Publisher: Altium Limited; SuppliersPartNumber: C225288
Q12 = SOT-23 MMBT5551  G1: 三极管; Package: SOT-23; Supplier: LC; SuppliersPartNumber: C2145
Q13 Q14 = SOT-23 MMBT5401 2L: 三极管; Package: SOT-23; Supplier: LC; SuppliersPartNumber: C8326
R45 R49 R51 = 0402 10K (1002) 1%: Chip resistor; Manufacturer: Uniroyal Elec; PartNumber: 0402WGF1002TCE; Power: 1/16W; Package: 0402; Supplier: LC; SuppliersPartNumber: C25744; Resistance: 10KΩ; Tolerance: 1%
R46 R52 = 0402 2K (2001) 1%: Chip resistor; Manufacturer: Uniroyal Elec; PartNumber: 0402WGF2001TCE; Power: 1/16W; Package: 0402; Supplier: LC; SuppliersPartNumber: C4109; Resistance: 2KΩ; Tolerance: 1%
  R46: ComponentLink1Description: Supplier link; ComponentLink1URL: http://www.szlcsc.com/product/details_4516.html
R47 R48 R55 = 0402 4.7K (4701) 1%: Chip resistor; Manufacturer: Uniroyal Elec; PartNumber: 0402WGF4701TCE; Power: 1/16W; Package: 0402; Supplier: LC; SuppliersPartNumber: C25900; Resistance: 4.7KΩ; Tolerance: 1%
  R47 R48: ComponentLink1Description: Supplier link; ComponentLink1URL: http://www.szlcsc.com/product/details_26643.html
R53 R57 R61 R63 = 0402 100K (1003) 1%: Chip resistor; Manufacturer: Uniroyal Elec; PartNumber: 0402WGF1003TCE; Power: 1/16W; Package: 0402; Supplier: LC; SuppliersPartNumber: C25741; Resistance: 100KΩ; Tolerance: 1%
R54 R59 R62 R64 = 0402 510R (5100) 1%: Chip resistor; Manufacturer: Uniroyal Elec; PartNumber: 0402WGF5100TCE; Power: 1/16W; Package: 0402; Supplier: LC; SuppliersPartNumber: C25123; Resistance: 510Ω; Tolerance: 1%
R56 = 0402 5.6K (5601) 1%: Chip resistor; Manufacturer: Uniroyal Elec; PartNumber: 0402WGF5601TCE; Power: 1/16W; Package: 0402; Supplier: LC; SuppliersPartNumber: C25908; Resistance: 5.6KΩ; Tolerance: 1%
R58 R60 = 0402 51K (5102) 1%: Chip resistor; Manufacturer: Uniroyal Elec; PartNumber: 0402WGF5102TCE; Power: 1/16W; Package: 0402; Supplier: LC; SuppliersPartNumber: C25794; Resistance: 51KΩ; Tolerance: 1%
U9 = DEV-16771: None; Package: None; Value: *
U10 = ULN2003AFWG_[C5437]: 大电流驱动; Package: SOIC-16_150mil; Supplier: LC; SuppliersPartNumber: C5437
U11 = 74HC14D_[C5605]: 74系列逻辑芯片; Package: SOIC-14_150mil; Supplier: LC; SuppliersPartNumber: C5605
U12 = CMP-0159-00216-1: IC EEPROM 16KBIT I2C 8SOIC; SuppliersPartNumber: C6480
VR1 = TO-252-2 L78M05ABDT-TR: DNI; Package: TO-252-2; Supplier: digikey; SuppliersPartNumber: C61534

## Sheet Limit_Switches.SchDoc: GRBLHAL_2000_EST
size B; Author: AM; CompanyName: Expatria Technologies; DrawnBy: A.Marles; Engineer: AM; Organization: Expatria Technologies; DocumentNumber: 5; Revision: A1; SheetNumber: 5; SheetTotal: 14; PCB_Rev: A1
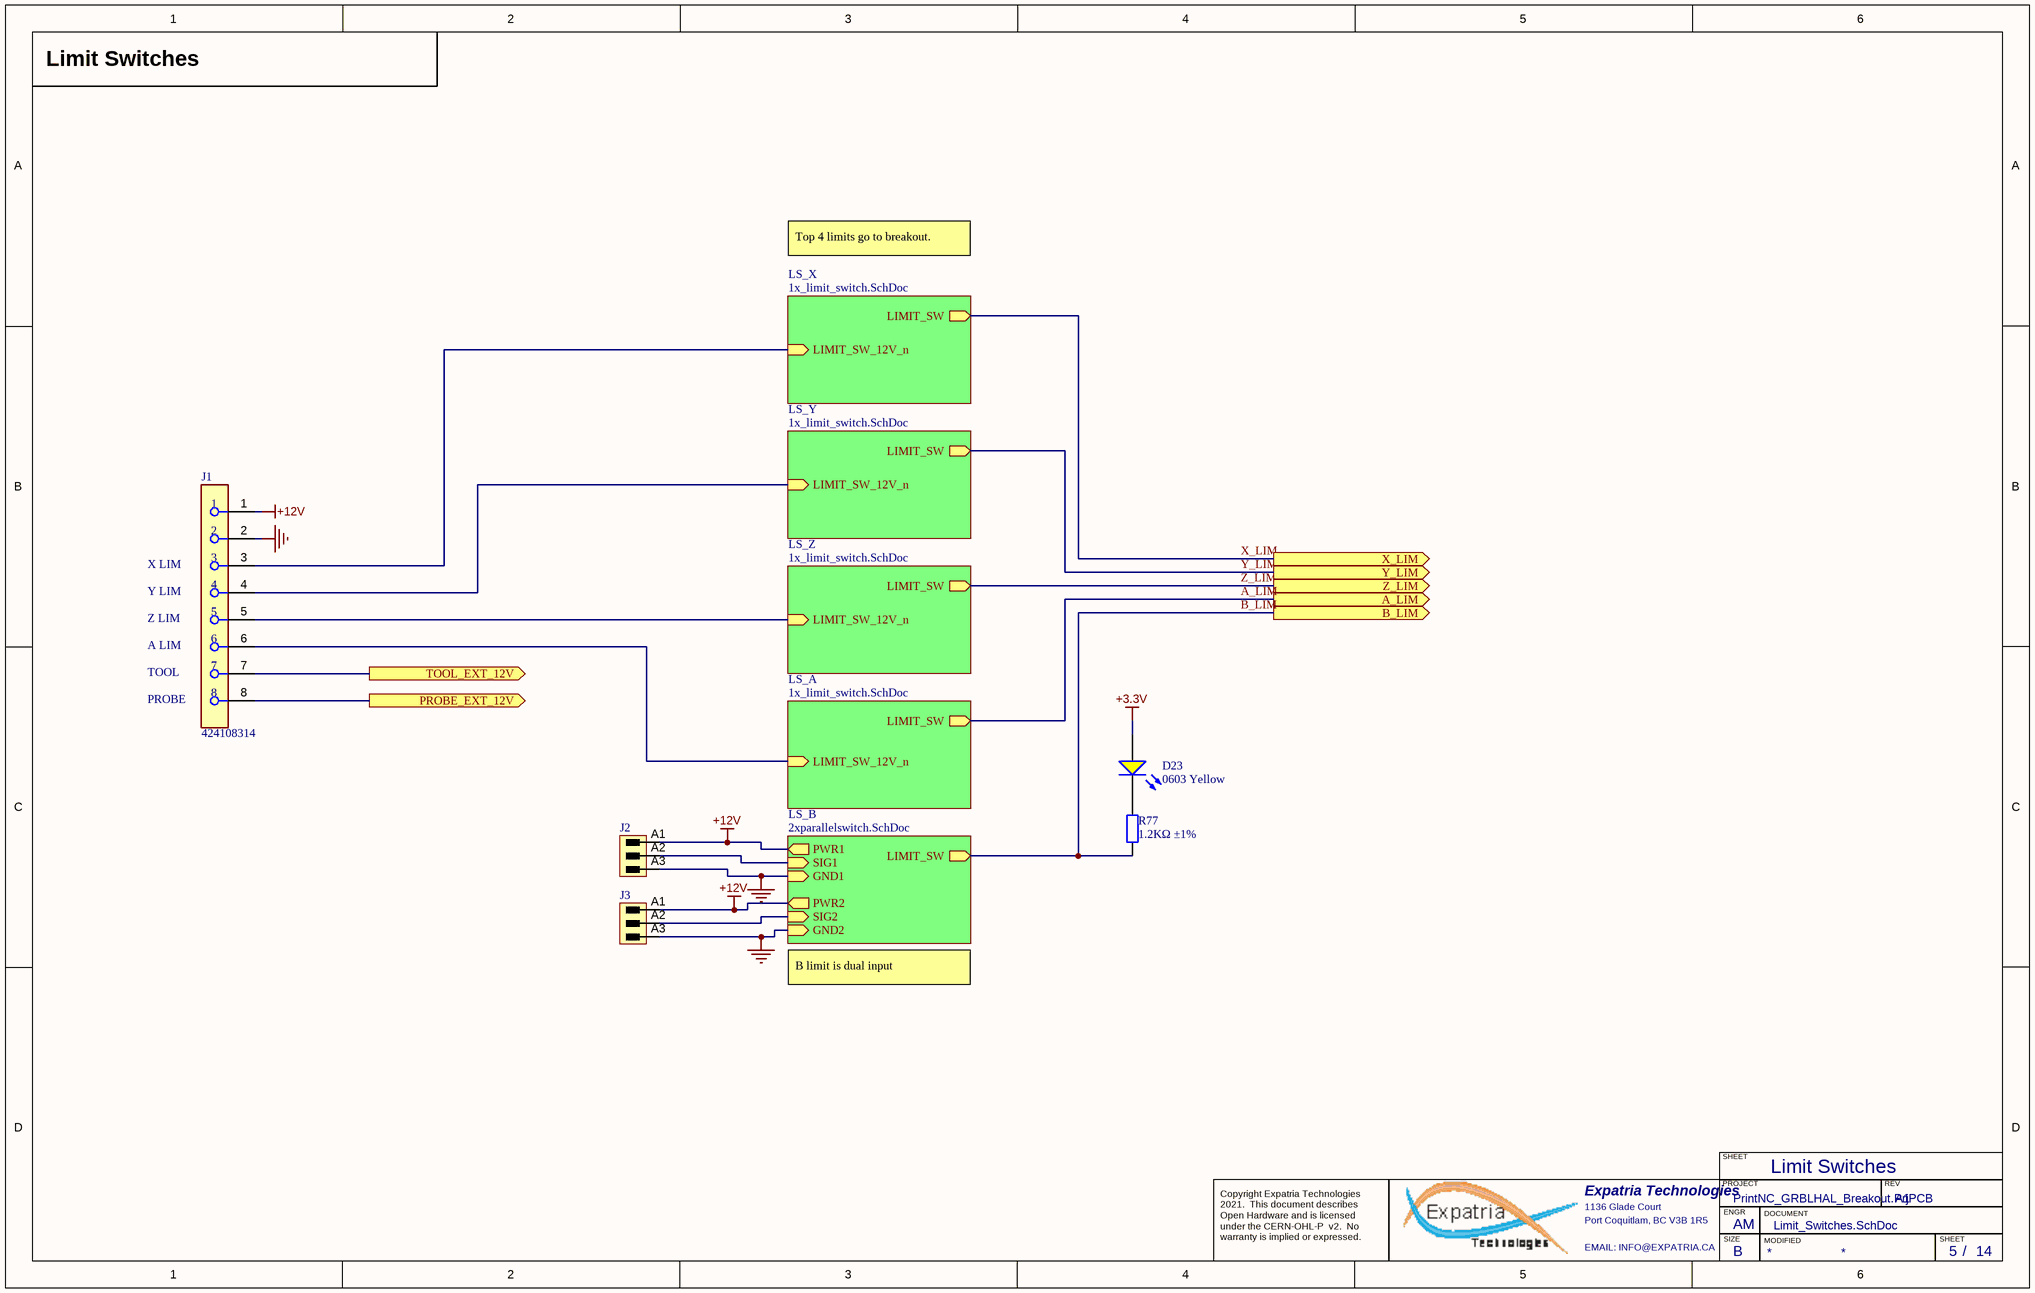
[diagram p5: Limit_Switches.SchDoc]

### Parts
D23  0603 Yellow  [0603_LED_S1]
J1  424108314  [FP-5555799-1-MFG]
J2  (no value)  [SL_3_50_180G_03]
J3  (no value)  [SL_3_50_180G_03]
R77  1.2KΩ ±1%  [0402_R]

### Sub-sheets
LS_A = 1x_limit_switch.SchDoc: LIMIT_SW (out), LIMIT_SW_12V_n (in)
LS_B = 2xparallelswitch.SchDoc: LIMIT_SW (out), SIG2 (in), GND2 (in), PWR2 (out), SIG1 (in), GND1 (in), PWR1 (out)
LS_X = 1x_limit_switch.SchDoc: LIMIT_SW (out), LIMIT_SW_12V_n (in)
LS_Y = 1x_limit_switch.SchDoc: LIMIT_SW (out), LIMIT_SW_12V_n (in)
LS_Z = 1x_limit_switch.SchDoc: LIMIT_SW (out), LIMIT_SW_12V_n (in)

### Ports
A_LIM (out), B_LIM (out), PROBE_EXT_12V (out), TOOL_EXT_12V (out), X_LIM (out), Y_LIM (out), Z_LIM (out)

### Nets
+3.3V: D23.A
+12V: J1.1 J2.A1 J3.A1 ; sheet LS_B/PWR2, sheet LS_B/PWR1
GND: J1.2 J2.A3 J3.A3 ; sheet LS_B/GND2, sheet LS_B/GND1
A_LIM: port A_LIM, sheet LS_A/LIMIT_SW
B_LIM: R77.1 ; port B_LIM, sheet LS_B/LIMIT_SW
LIMIT_SW: J1.3 ; sheet LS_X/LIMIT_SW_12V_n
LIMIT_SW: J1.4 ; sheet LS_Y/LIMIT_SW_12V_n  [a separate net that carries the same name]
LIMIT_SW: J1.5 ; sheet LS_Z/LIMIT_SW_12V_n  [a separate net that carries the same name]
LIMIT_SW: J1.6 ; sheet LS_A/LIMIT_SW_12V_n  [a separate net that carries the same name]
MAXLIM: J1.8 ; port PROBE_EXT_12V
MAXLIM: J3.A2 ; sheet LS_B/SIG2  [a separate net that carries the same name]
MINLIM: J1.7 ; port TOOL_EXT_12V
MINLIM: J2.A2 ; sheet LS_B/SIG1  [a separate net that carries the same name]
X_LIM: port X_LIM, sheet LS_X/LIMIT_SW
Y_LIM: port Y_LIM, sheet LS_Y/LIMIT_SW
Z_LIM: port Z_LIM, sheet LS_Z/LIMIT_SW
NetD23_K: D23.K R77.2

### Notes on the sheet
- Limit Switches
- Top 4 limits go to breakout.
- (near J1) X LIM
- (near J1) Y LIM
- (near J1) Z LIM
- (near J1) A LIM
- TOOL
- (near J1) PROBE
- B limit is dual input
- SHEET
- Expatria Technologies
- 1136 Glade Court
- Port Coquitlam, BC V3B 1R5
- PROJECT
- SIZE
- ENGR
- MODIFIED
- DOCUMENT
- REV
- Copyright Expatria Technologies 2021.  This document describes Open Hardware and is licensed under the CERN-OHL-P  v2.  No warranty is implied or expressed.
- EMAIL: INFO@EXPATRIA.CA
- B
- /

### Library data of the parts
D23 = 0603 LED Yellow: LED; Package: 0603; Supplier: LC; SuppliersPartNumber: C72038; Color: Yellow
J1 = CMP-03371-000003-1: CONN MOD JACK 8P8C VERT UNSHLD; SuppliersPartNumber: C563815; Supplier: LCSC
J2 J3 = CMP-1559-00904-1: Header,Male Pin,Covered(4 Sided) 3 1 0.138"（3.50mm） 3 P=3.5mm Pluggable System Terminal Block RoHS; PartNumber: WJ15EDGVC-3.5-3P; Manufacturer: Ningbo Kangnex Elec; Pitch_mm: 3.5 mm; UL_94_flammability_rating: V-0; Side_termination_characteristic: closed side; Solder_pin_length_mm: 3.2 mm; Short_text_for_material: SL 3.50/03/180G 3.2SN OR BX; Pitch_inch: 0.138 inch; PackageReference: SL_3_50_180G_03; Packaging: Box; Revision: V1; SuppliersPartNumber: C192778
R77 = 0402 1.2K (1201) 1%: Chip resistor; Manufacturer: Uniroyal Elec; PartNumber: 0402WGF1201TCE; Power: 1/16W; Package: 0402; Supplier: LC; SuppliersPartNumber: C25862; Resistance: 1.2KΩ; Tolerance: 1%

## Sheet 1x_limit_switch.SchDoc: GRBLHAL_2000_EST
size B; Author: AM; CompanyName: Expatria Technologies; DrawnBy: A.Marles; Engineer: AM; Organization: Expatria Technologies; DocumentNumber: 6; Revision: A1; SheetNumber: 6; SheetTotal: 14; PCB_Rev: A1
Used 4 times, as channels U_PrintNC_BREAKOUT/LIM_SW/LS_X, U_PrintNC_BREAKOUT/LIM_SW/LS_Y, U_PrintNC_BREAKOUT/LIM_SW/LS_Z, U_PrintNC_BREAKOUT/LIM_SW/LS_A. Parts and nets are listed once, with the designators drawn on the sheet.
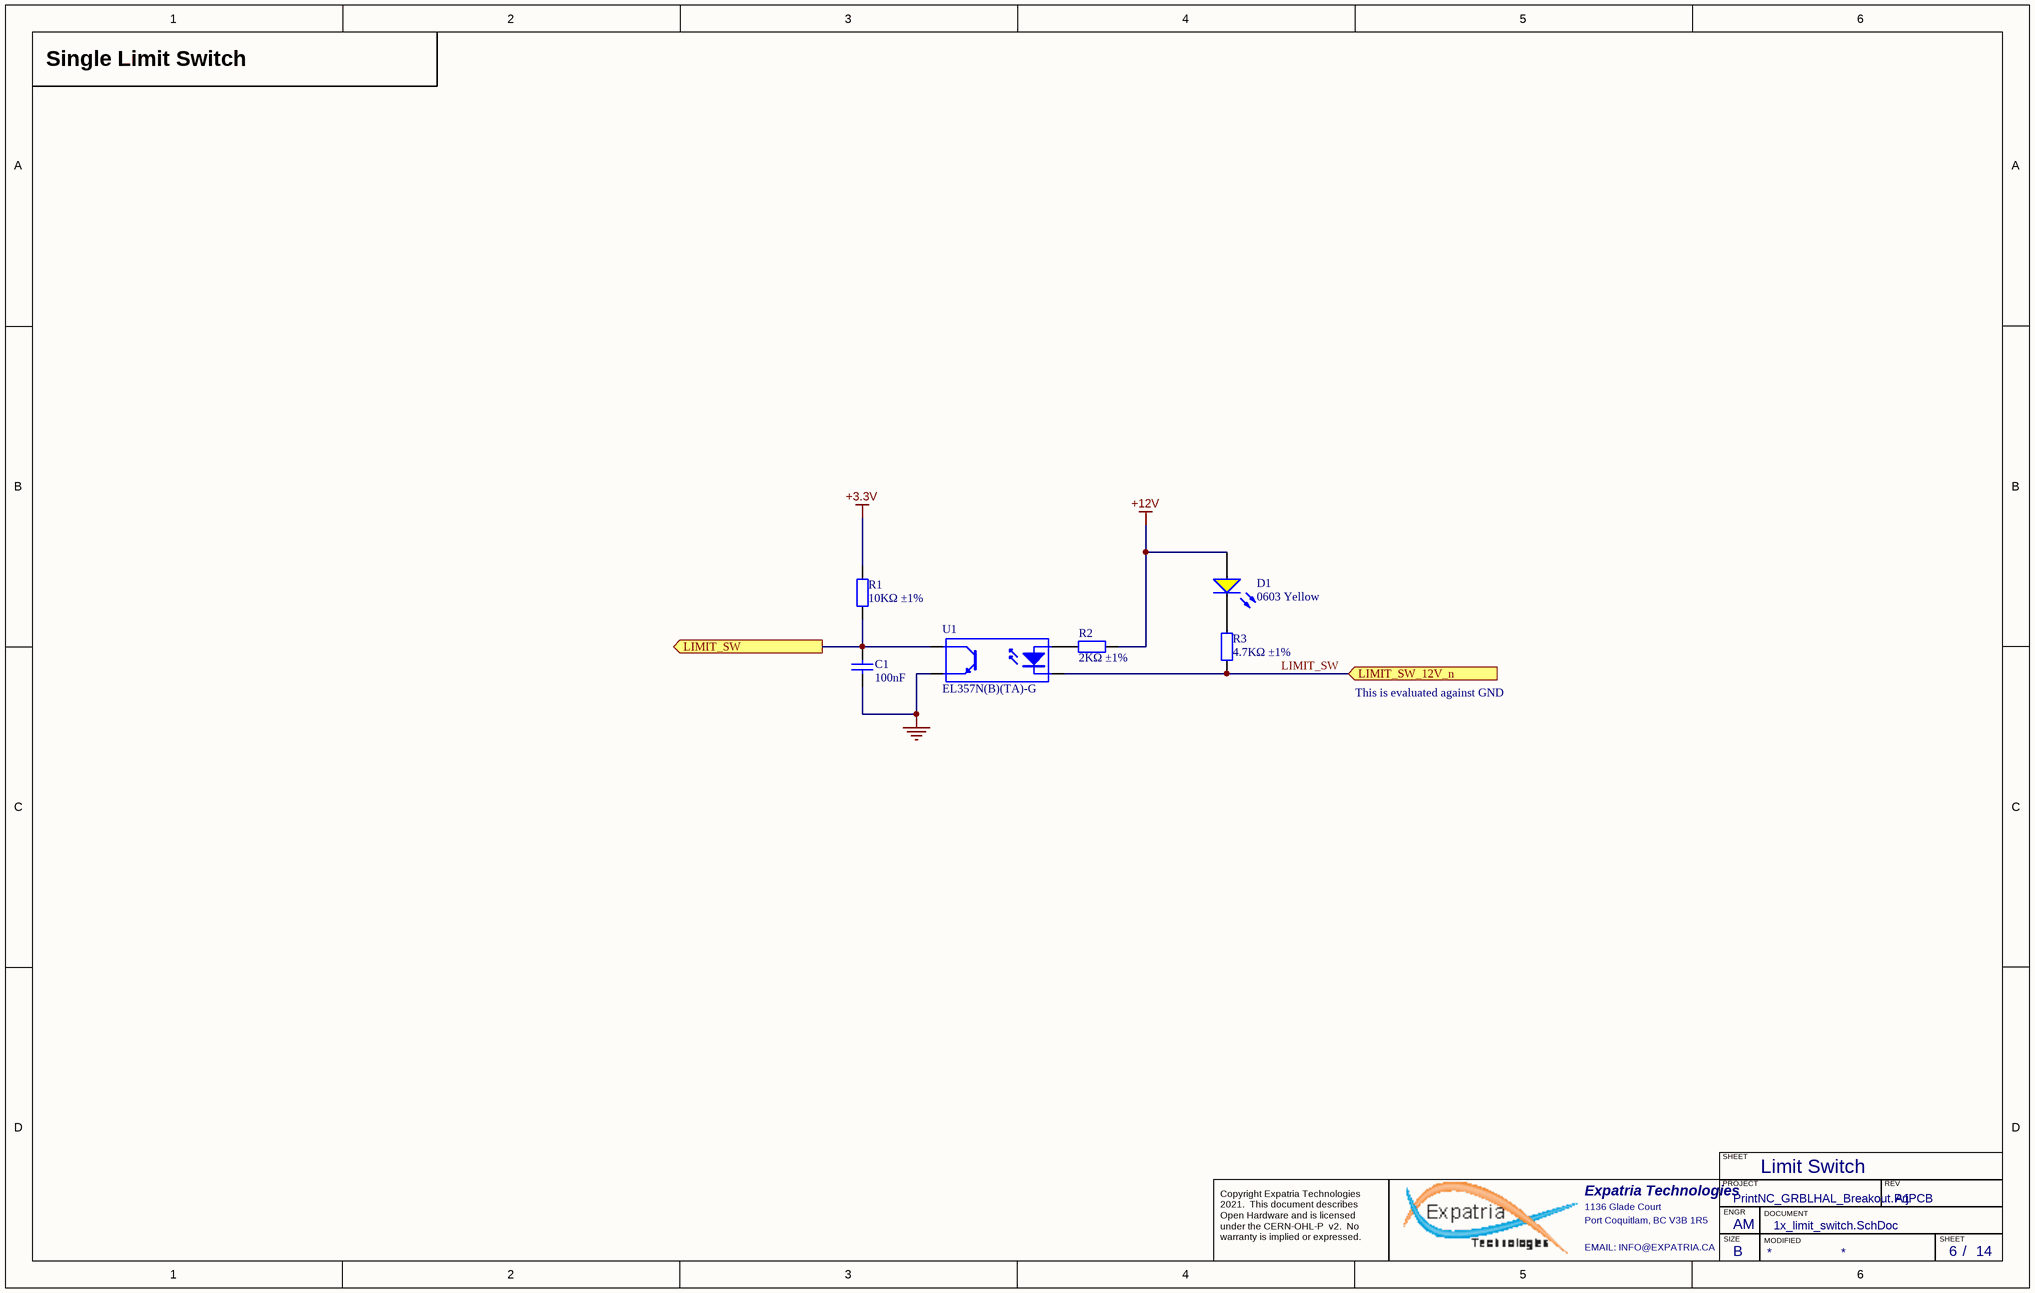
[diagram p6: 1x_limit_switch.SchDoc]

### Parts
C1  100nF  [0402_C]
D1  0603 Yellow  [0603_LED_S1]
R1  10KΩ ±1%  [0402_R]
R2  2KΩ ±1%  [0402_R]
R3  4.7KΩ ±1%  [0402_R]
U1  EL357N(B)(TA)-G  [SOP-4_P2.54]

### Ports
LIMIT_SW (out), LIMIT_SW_12V_n (in)

### Nets
+3.3V: R1.2
+12V: D1.A R2.2
GND: C1.1 U1.3(E)
LIMIT_SW: R3.1 U1.2(K) ; port LIMIT_SW_12V_n
LIMIT_SW: C1.2 R1.1 U1.4(C) ; port LIMIT_SW  [a separate net that carries the same name]
NetD1_K: D1.K R3.2
NetR2_1: R2.1 U1.1(A)

### Channels
U_PrintNC_BREAKOUT/LIM_SW/LS_X: designators end in _LS_X; ports LIMIT_SW=X_LIM LIMIT_SW_12V_n=LIMIT_SW
U_PrintNC_BREAKOUT/LIM_SW/LS_Y: designators end in _LS_Y; ports LIMIT_SW=Y_LIM LIMIT_SW_12V_n=LIMIT_SW
U_PrintNC_BREAKOUT/LIM_SW/LS_Z: designators end in _LS_Z; ports LIMIT_SW=Z_LIM LIMIT_SW_12V_n=LIMIT_SW
U_PrintNC_BREAKOUT/LIM_SW/LS_A: designators end in _LS_A; ports LIMIT_SW=A_LIM LIMIT_SW_12V_n=LIMIT_SW

### Notes on the sheet
- Single Limit Switch
- This is evaluated against GND
- Limit Switch
- SHEET
- Expatria Technologies
- 1136 Glade Court
- Port Coquitlam, BC V3B 1R5
- PROJECT
- SIZE
- ENGR
- MODIFIED
- DOCUMENT
- REV
- Copyright Expatria Technologies 2021.  This document describes Open Hardware and is licensed under the CERN-OHL-P  v2.  No warranty is implied or expressed.
- EMAIL: INFO@EXPATRIA.CA
- B
- /

### Library data of the parts
C1 = 0402 100nF (104) 10% 16V: as C13 on sheet PrintNC_CNC_Breakout; Package: 0402; Supplier: LC; SuppliersPartNumber: C1525; Capacitance: 100nF
D1 = 0603 LED Yellow: LED; Package: 0603; Supplier: LC; SuppliersPartNumber: C72038; Color: Yellow
R1 = 0402 10K (1002) 1%: as R45 on sheet PrintNC_CNC_Breakout; Package: 0402; Supplier: LC; SuppliersPartNumber: C25744; Resistance: 10KΩ; Tolerance: 1%
R2 = 0402 2K (2001) 1%: as R46 on sheet PrintNC_CNC_Breakout; Package: 0402; Supplier: LC; SuppliersPartNumber: C4109; Resistance: 2KΩ; Tolerance: 1%
R3 = 0402 4.7K (4701) 1%: as R47 on sheet PrintNC_CNC_Breakout; Package: 0402; Supplier: LC; SuppliersPartNumber: C25900; Resistance: 4.7KΩ; Tolerance: 1%
U1 = EL357N(B)(TA)-G_[C6649]: 贴片光耦; Package: SOP-4_P2.54; Supplier: LC; SuppliersPartNumber: C6649

## Sheet 2xparallelswitch.SchDoc: GRBLHAL_2000_EST
size B; Author: AM; CompanyName: Expatria Technologies; DrawnBy: A.Marles; Engineer: AM; Organization: Expatria Technologies; DocumentNumber: 6; Revision: A1; SheetNumber: 6; SheetTotal: 14; PCB_Rev: A1
Used 2 times, as channels U_PrintNC_BREAKOUT/LIM_SW/LS_B, U_PrintNC_BREAKOUT/USR_SW/PH_PR. Parts and nets are listed once, with the designators drawn on the sheet.
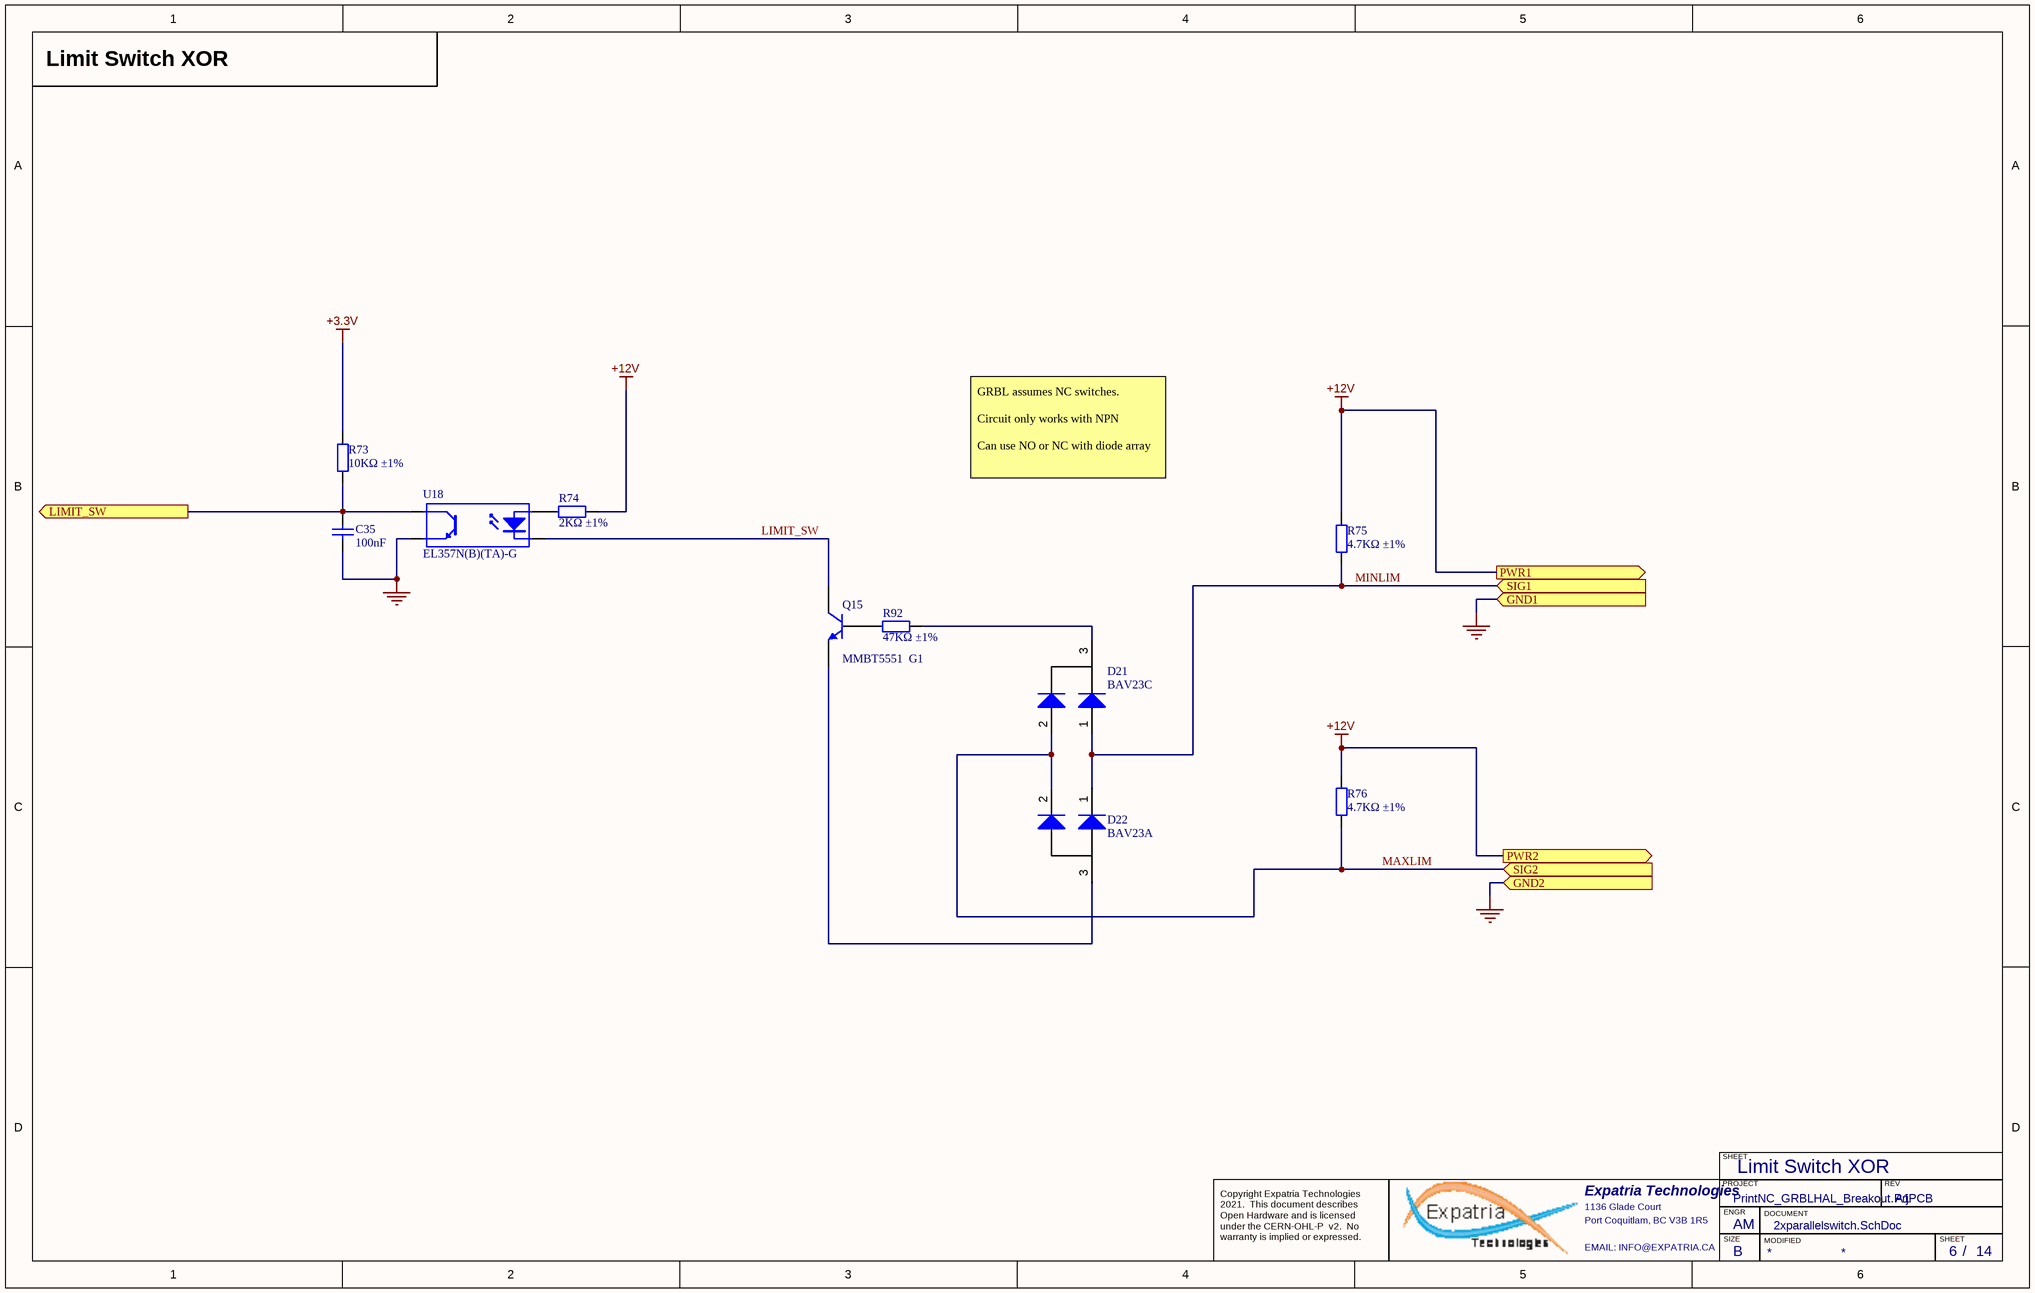
[diagram p7: 2xparallelswitch.SchDoc]

### Parts
C35  100nF  [0402_C]
D21  BAV23C  [SOT-23(SOT-23-3)]
D22  BAV23A  [SOT-23(SOT-23-3)]
Q15  MMBT5551  G1  [SOT-23(SOT-23-3)]
R73  10KΩ ±1%  [0402_R]
R74  2KΩ ±1%  [0402_R]
R75  4.7KΩ ±1%  [0402_R]
R76  4.7KΩ ±1%  [0402_R]
R92  47KΩ ±1%  [0402_R]
U18  EL357N(B)(TA)-G  [SOP-4_P2.54]

### Ports
GND1 (in), GND2 (in), LIMIT_SW (out), PWR1 (out), PWR2 (out), SIG1 (in), SIG2 (in)

### Nets
+3.3V: R73.2
+12V: R74.2 R75.2 R76.2 ; port PWR1, port PWR2
GND: C35.1 U18.3(E) ; port GND1, port GND2
LIMIT_SW: Q15.3(C) U18.2(K)
LIMIT_SW: C35.2 R73.1 U18.4(C) ; port LIMIT_SW  [a separate net that carries the same name]
MAXLIM: D21.2(A) D22.2(K) R76.1 ; port SIG2
MINLIM: D21.1(A) D22.1(K) R75.1 ; port SIG1
NetD21_3: D21.3(K) R92.1
NetD22_3: D22.3(A) Q15.2(E)
NetQ15_1: Q15.1(B) R92.2
NetR74_1: R74.1 U18.1(A)

### Channels
U_PrintNC_BREAKOUT/LIM_SW/LS_B: designators end in _LS_B; ports GND1=GND GND2=GND LIMIT_SW=B_LIM PWR1=+12V PWR2=+12V SIG1=MINLIM SIG2=MAXLIM
U_PrintNC_BREAKOUT/USR_SW/PH_PR: designators end in _PH_PR; ports GND1=GND GND2=GND LIMIT_SW=PROBE PWR1=+12V PWR2=+12V SIG1=MINLIM SIG2=MAXLIM

### Notes on the sheet
- Limit Switch XOR
- GRBL assumes NC switches.
  Circuit only works with NPN
  Can use NO or NC with diode array
- SHEET
- Expatria Technologies
- 1136 Glade Court
- Port Coquitlam, BC V3B 1R5
- PROJECT
- SIZE
- ENGR
- MODIFIED
- DOCUMENT
- REV
- Copyright Expatria Technologies 2021.  This document describes Open Hardware and is licensed under the CERN-OHL-P  v2.  No warranty is implied or expressed.
- EMAIL: INFO@EXPATRIA.CA
- B
- /

### Library data of the parts
C35 = 0402 100nF (104) 10% 16V: as C13 on sheet PrintNC_CNC_Breakout; Package: 0402; Supplier: LC; SuppliersPartNumber: C1525; Capacitance: 100nF
D21 = SOT-23 BAV23C: 250V +150℃@(Tj) 350mW Dual Common Cathode 1.25V@200mA 50ns 100nA@250V 225mA SOT-23 Switching Diode ROHS; ComponentLink1Description: 供应商链接; ComponentLink1URL: http://www.szlcsc.com/product/details_70091.html; Package: SOT-23; Supplier: LC; SuppliersPartNumber: C545540
D22 = SOT-23 BAV23A: 200V -65℃~+150℃@(Tj) 350mW 1 Pair Common Anode 1.25V@200mA 50ns 100nA@200V 400mA SOT-23 Switching Diode ROHS; ComponentLink1Description: 供应商链接; ComponentLink1URL: http://www.szlcsc.com/product/details_70091.html; Package: SOT-23; Supplier: LC; SuppliersPartNumber: C328584
Q15 = SOT-23 MMBT5551  G1: 三极管; ComponentLink1Description: 供应商链接; ComponentLink1URL: http://www.szlcsc.com/product/details_2502.html; Package: SOT-23; Supplier: LC; SuppliersPartNumber: C2145
R73 = 0402 10K (1002) 1%: as R45 on sheet PrintNC_CNC_Breakout; Package: 0402; Supplier: LC; SuppliersPartNumber: C25744; Resistance: 10KΩ; Tolerance: 1%
R74 = 0402 2K (2001) 1%: as R46 on sheet PrintNC_CNC_Breakout; ComponentLink1Description: Supplier link; ComponentLink1URL: http://www.szlcsc.com/product/details_4516.html; Package: 0402; Supplier: LC; SuppliersPartNumber: C4109; Resistance: 2KΩ; Tolerance: 1%
R75 R76 = 0402 4.7K (4701) 1%: as R47 on sheet PrintNC_CNC_Breakout; ComponentLink1Description: Supplier link; ComponentLink1URL: http://www.szlcsc.com/product/details_26643.html; Package: 0402; Supplier: LC; SuppliersPartNumber: C25900; Resistance: 4.7KΩ; Tolerance: 1%
R92 = 0402 47K (4702) 1%: Chip resistor; Manufacturer: Uniroyal Elec; PartNumber: 0402WGF4702TCE; Power: 1/16W; ComponentLink1Description: Supplier link; ComponentLink1URL: http://www.szlcsc.com/product/details_26535.html; Package: 0402; Supplier: LC; SuppliersPartNumber: C25792; Resistance: 47KΩ; Tolerance: 1%
U18 = EL357N(B)(TA)-G_[C6649]: 贴片光耦; Package: SOP-4_P2.54; Supplier: LC; SuppliersPartNumber: C6649

## Sheet Misc_switches.SchDoc: GRBLHAL_2000_EST
size B; Author: AM; CompanyName: Expatria Technologies; DrawnBy: A.Marles; Engineer: AM; Organization: Expatria Technologies; DocumentNumber: 7; Revision: A1; SheetNumber: 7; SheetTotal: 14; PCB_Rev: A1
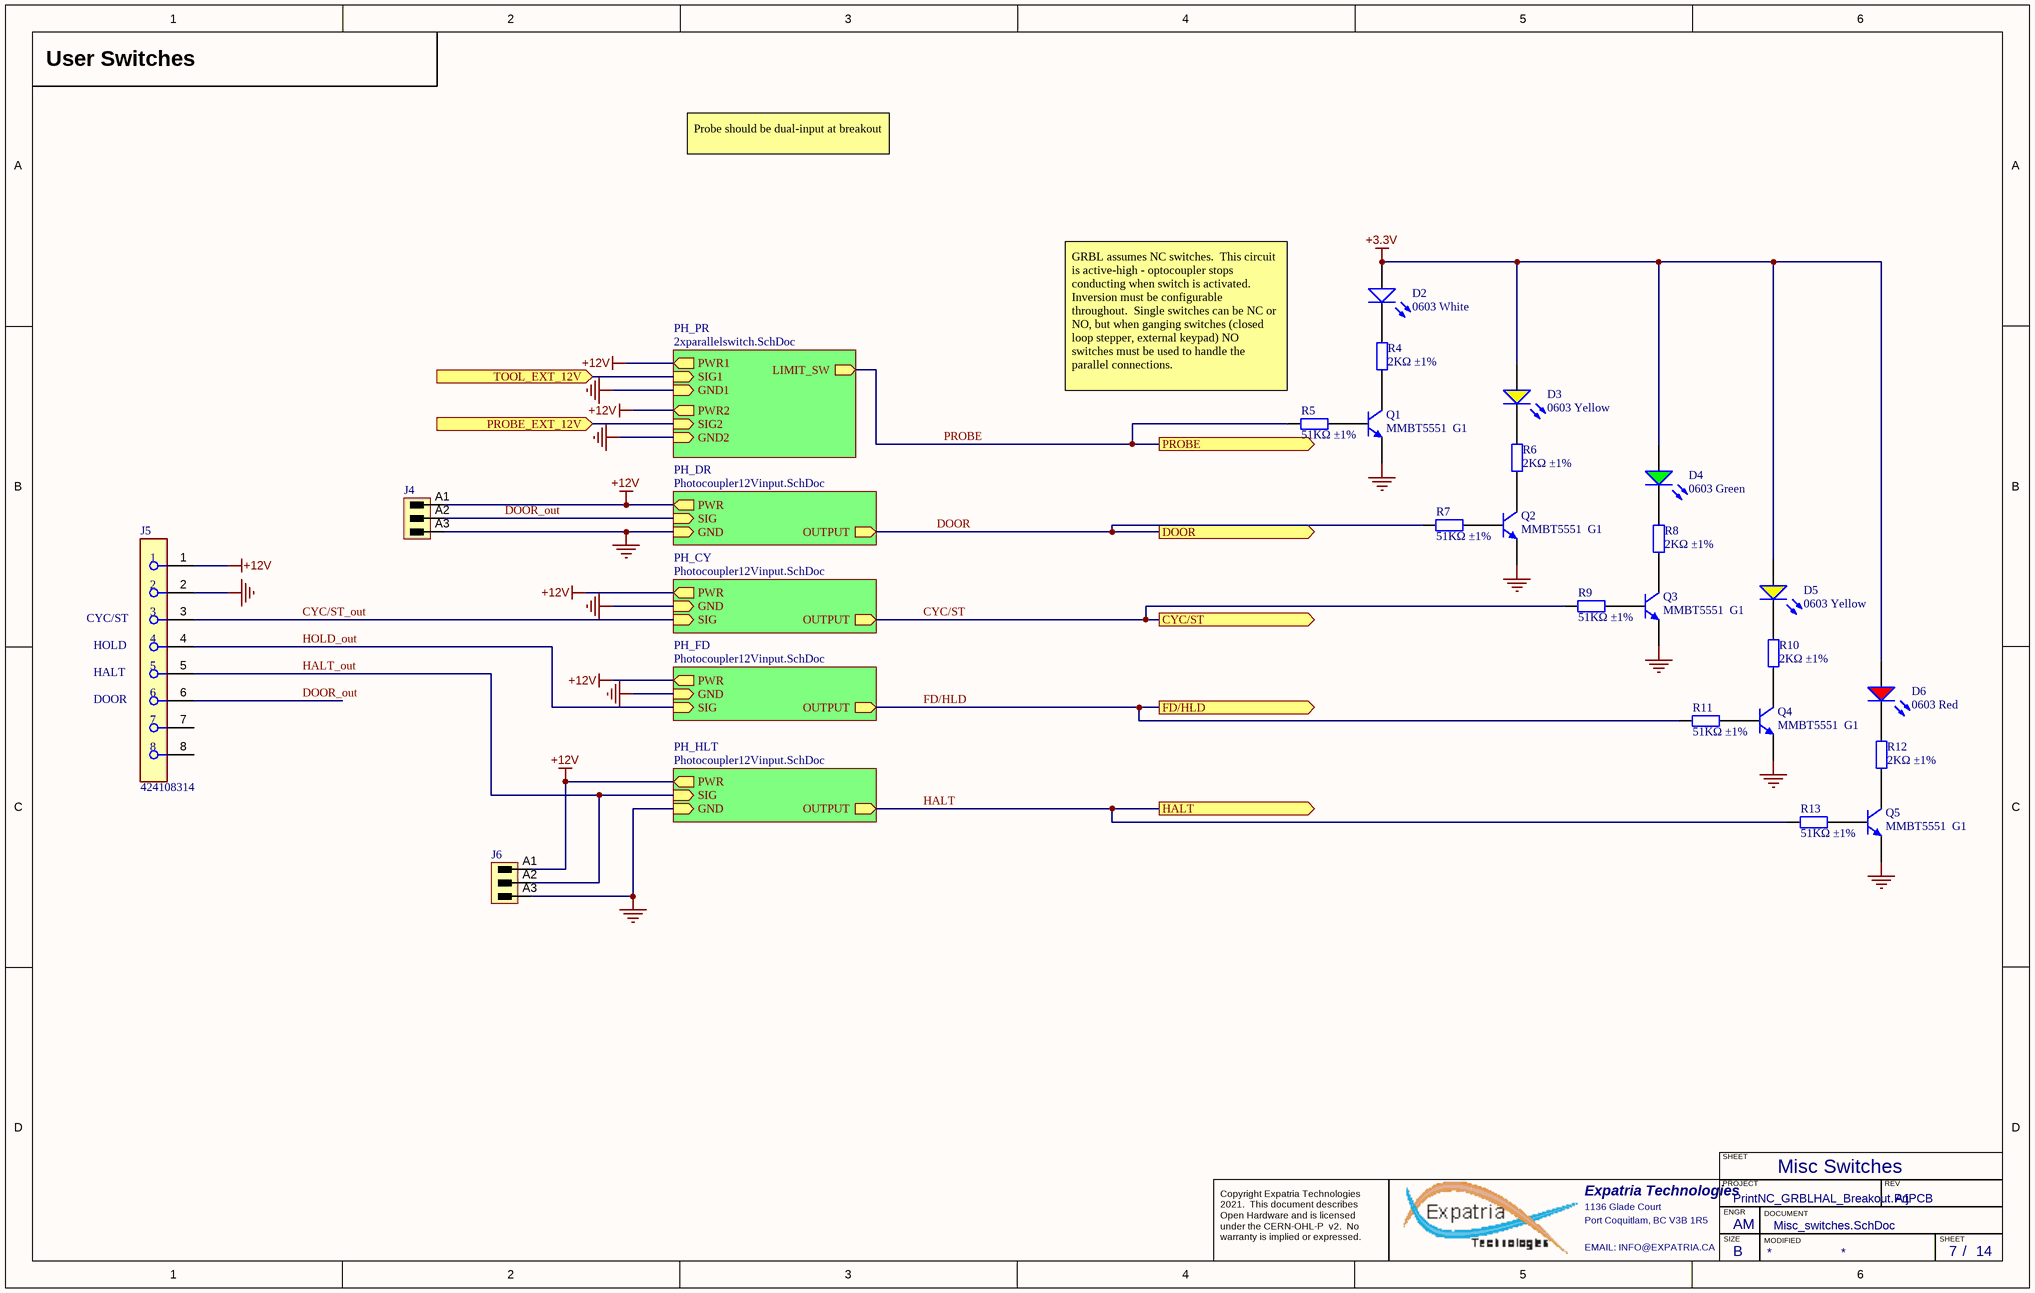
[diagram p8: Misc_switches.SchDoc]

### Parts
D2  0603 White  [0603_LED_S1]
D3  0603 Yellow  [0603_LED_S1]
D4  0603 Green  [0603_LED_S1]
D5  0603 Yellow  [0603_LED_S1]
D6  0603 Red  [0603_LED_S1]
J4  (no value)  [SL_3_50_180G_03]
J5  424108314  [FP-5555799-1-MFG]
J6  (no value)  [SL_3_50_180G_03]
Q1  MMBT5551  G1  [SOT-23(SOT-23-3)]
Q2  MMBT5551  G1  [SOT-23(SOT-23-3)]
Q3  MMBT5551  G1  [SOT-23(SOT-23-3)]
Q4  MMBT5551  G1  [SOT-23(SOT-23-3)]
Q5  MMBT5551  G1  [SOT-23(SOT-23-3)]
R4  2KΩ ±1%  [0402_R]
R5  51KΩ ±1%  [0402_R]
R6  2KΩ ±1%  [0402_R]
R7  51KΩ ±1%  [0402_R]
R8  2KΩ ±1%  [0402_R]
R9  51KΩ ±1%  [0402_R]
R10  2KΩ ±1%  [0402_R]
R11  51KΩ ±1%  [0402_R]
R12  2KΩ ±1%  [0402_R]
R13  51KΩ ±1%  [0402_R]

### Sub-sheets
PH_CY = Photocoupler12Vinput.SchDoc: OUTPUT (out), GND (in), SIG (in), PWR (out)
PH_DR = Photocoupler12Vinput.SchDoc: OUTPUT (out), PWR (out), SIG (in), GND (in)
PH_FD = Photocoupler12Vinput.SchDoc: OUTPUT (out), PWR (out), GND (in), SIG (in)
PH_HLT = Photocoupler12Vinput.SchDoc: OUTPUT (out), GND (in), PWR (out), SIG (in)
PH_PR = 2xparallelswitch.SchDoc: LIMIT_SW (out), GND1 (in), PWR2 (out), GND2 (in), SIG2 (in), SIG1 (in), PWR1 (out)

### Ports
CYC/ST (out), DOOR (out), FD/HLD (out), HALT (out), PROBE (out), PROBE_EXT_12V (in), TOOL_EXT_12V (in)

### Nets
+3.3V: D2.A D3.A D4.A D5.A D6.A
+12V: J4.A1 J5.1 J6.A1 ; sheet PH_DR/PWR, sheet PH_CY/PWR, sheet PH_FD/PWR, sheet PH_HLT/PWR, sheet PH_PR/PWR2, sheet PH_PR/PWR1
GND: J4.A3 J5.2 J6.A3 Q1.2(E) Q2.2(E) Q3.2(E) Q4.2(E) Q5.2(E) ; sheet PH_DR/GND, sheet PH_CY/GND, sheet PH_FD/GND, sheet PH_HLT/GND, sheet PH_PR/GND1, sheet PH_PR/GND2
CYC/ST: R9.1 ; port CYC/ST, sheet PH_CY/OUTPUT
CYC/ST_out: J5.3 ; sheet PH_CY/SIG
DOOR: R7.1 ; port DOOR, sheet PH_DR/OUTPUT
DOOR_out: J4.A2 J5.6 ; sheet PH_DR/SIG
FD/HLD: R11.1 ; port FD/HLD, sheet PH_FD/OUTPUT
HALT: R13.1 ; port HALT, sheet PH_HLT/OUTPUT
HALT_out: J5.5 J6.A2 ; sheet PH_HLT/SIG
HOLD_out: J5.4 ; sheet PH_FD/SIG
MAXLIM: port PROBE_EXT_12V, sheet PH_PR/SIG2
MINLIM: port TOOL_EXT_12V, sheet PH_PR/SIG1
PROBE: R5.1 ; port PROBE, sheet PH_PR/LIMIT_SW
NetD2_K: D2.K R4.1
NetD3_K: D3.K R6.1
NetD4_K: D4.K R8.1
NetD5_K: D5.K R10.1
NetD6_K: D6.K R12.1
NetQ1_1: Q1.1(B) R5.2
NetQ1_3: Q1.3(C) R4.2
NetQ2_1: Q2.1(B) R7.2
NetQ2_3: Q2.3(C) R6.2
NetQ3_1: Q3.1(B) R9.2
NetQ3_3: Q3.3(C) R8.2
NetQ4_1: Q4.1(B) R11.2
NetQ4_3: Q4.3(C) R10.2
NetQ5_1: Q5.1(B) R13.2
NetQ5_3: Q5.3(C) R12.2

Not connected (* = marked no-connect by the designer): J5 7 8

### Notes on the sheet
- User Switches
- Probe should be dual-input at breakout
- (near R5) GRBL assumes NC switches.  This circuit is active-high - optocoupler stops conducting when switch is activated.  Inversion must be configurable throughout.  Single switches can be NC or NO, but when ganging switches (closed loop stepper, external keypad) NO switches must be used to handle the parallel connections.
- (near J5) CYC/ST
- (near J5) HOLD
- (near J5) HALT
- (near J5) DOOR
- Misc Switches
- SHEET
- Expatria Technologies
- 1136 Glade Court
- Port Coquitlam, BC V3B 1R5
- PROJECT
- SIZE
- ENGR
- MODIFIED
- DOCUMENT
- REV
- Copyright Expatria Technologies 2021.  This document describes Open Hardware and is licensed under the CERN-OHL-P  v2.  No warranty is implied or expressed.
- EMAIL: INFO@EXPATRIA.CA
- B
- /

### Library data of the parts
D2 = 0603 LED White: LED; Package: 0603; Supplier: LC; SuppliersPartNumber: C2290; Color: White
D3 D5 = 0603 LED Yellow: LED; Package: 0603; Supplier: LC; SuppliersPartNumber: C72038; Color: Yellow
D4 = 0603 LED Green: LED; Package: 0603; Supplier: LC; SuppliersPartNumber: C72043; Color: Green
D6 = 0603 LED Red: LED; Package: 0603; Supplier: LC; SuppliersPartNumber: C2286; Color: Red
J4 J6 = CMP-1559-00904-1: as J2 on sheet Limit_Switches; PackageReference: SL_3_50_180G_03; Packaging: Box; Revision: V1; SuppliersPartNumber: C192778
J5 = CMP-03371-000003-1: CONN MOD JACK 8P8C VERT UNSHLD; SuppliersPartNumber: C563815; Supplier: LCSC
Q1-Q5 = SOT-23 MMBT5551  G1: 三极管; Package: SOT-23; Supplier: LC; SuppliersPartNumber: C2145
R4 R6 R8 R10 R12 = 0402 2K (2001) 1%: as R46 on sheet PrintNC_CNC_Breakout; Package: 0402; Supplier: LC; SuppliersPartNumber: C4109; Resistance: 2KΩ; Tolerance: 1%
R5 R7 R9 R11 R13 = 0402 51K (5102) 1%: as R58 on sheet PrintNC_CNC_Breakout; Package: 0402; Supplier: LC; SuppliersPartNumber: C25794; Resistance: 51KΩ; Tolerance: 1%

## Sheet Photocoupler12Vinput.SchDoc: GRBLHAL_2000_EST
size B; Author: AM; CompanyName: Expatria Technologies; DrawnBy: A.Marles; Engineer: AM; Organization: Expatria Technologies; DocumentNumber: 8; Revision: A1; SheetNumber: 8; SheetTotal: 14; PCB_Rev: A1
Used 4 times, as channels U_PrintNC_BREAKOUT/USR_SW/PH_DR, U_PrintNC_BREAKOUT/USR_SW/PH_CY, U_PrintNC_BREAKOUT/USR_SW/PH_FD, U_PrintNC_BREAKOUT/USR_SW/PH_HLT. Parts and nets are listed once, with the designators drawn on the sheet.
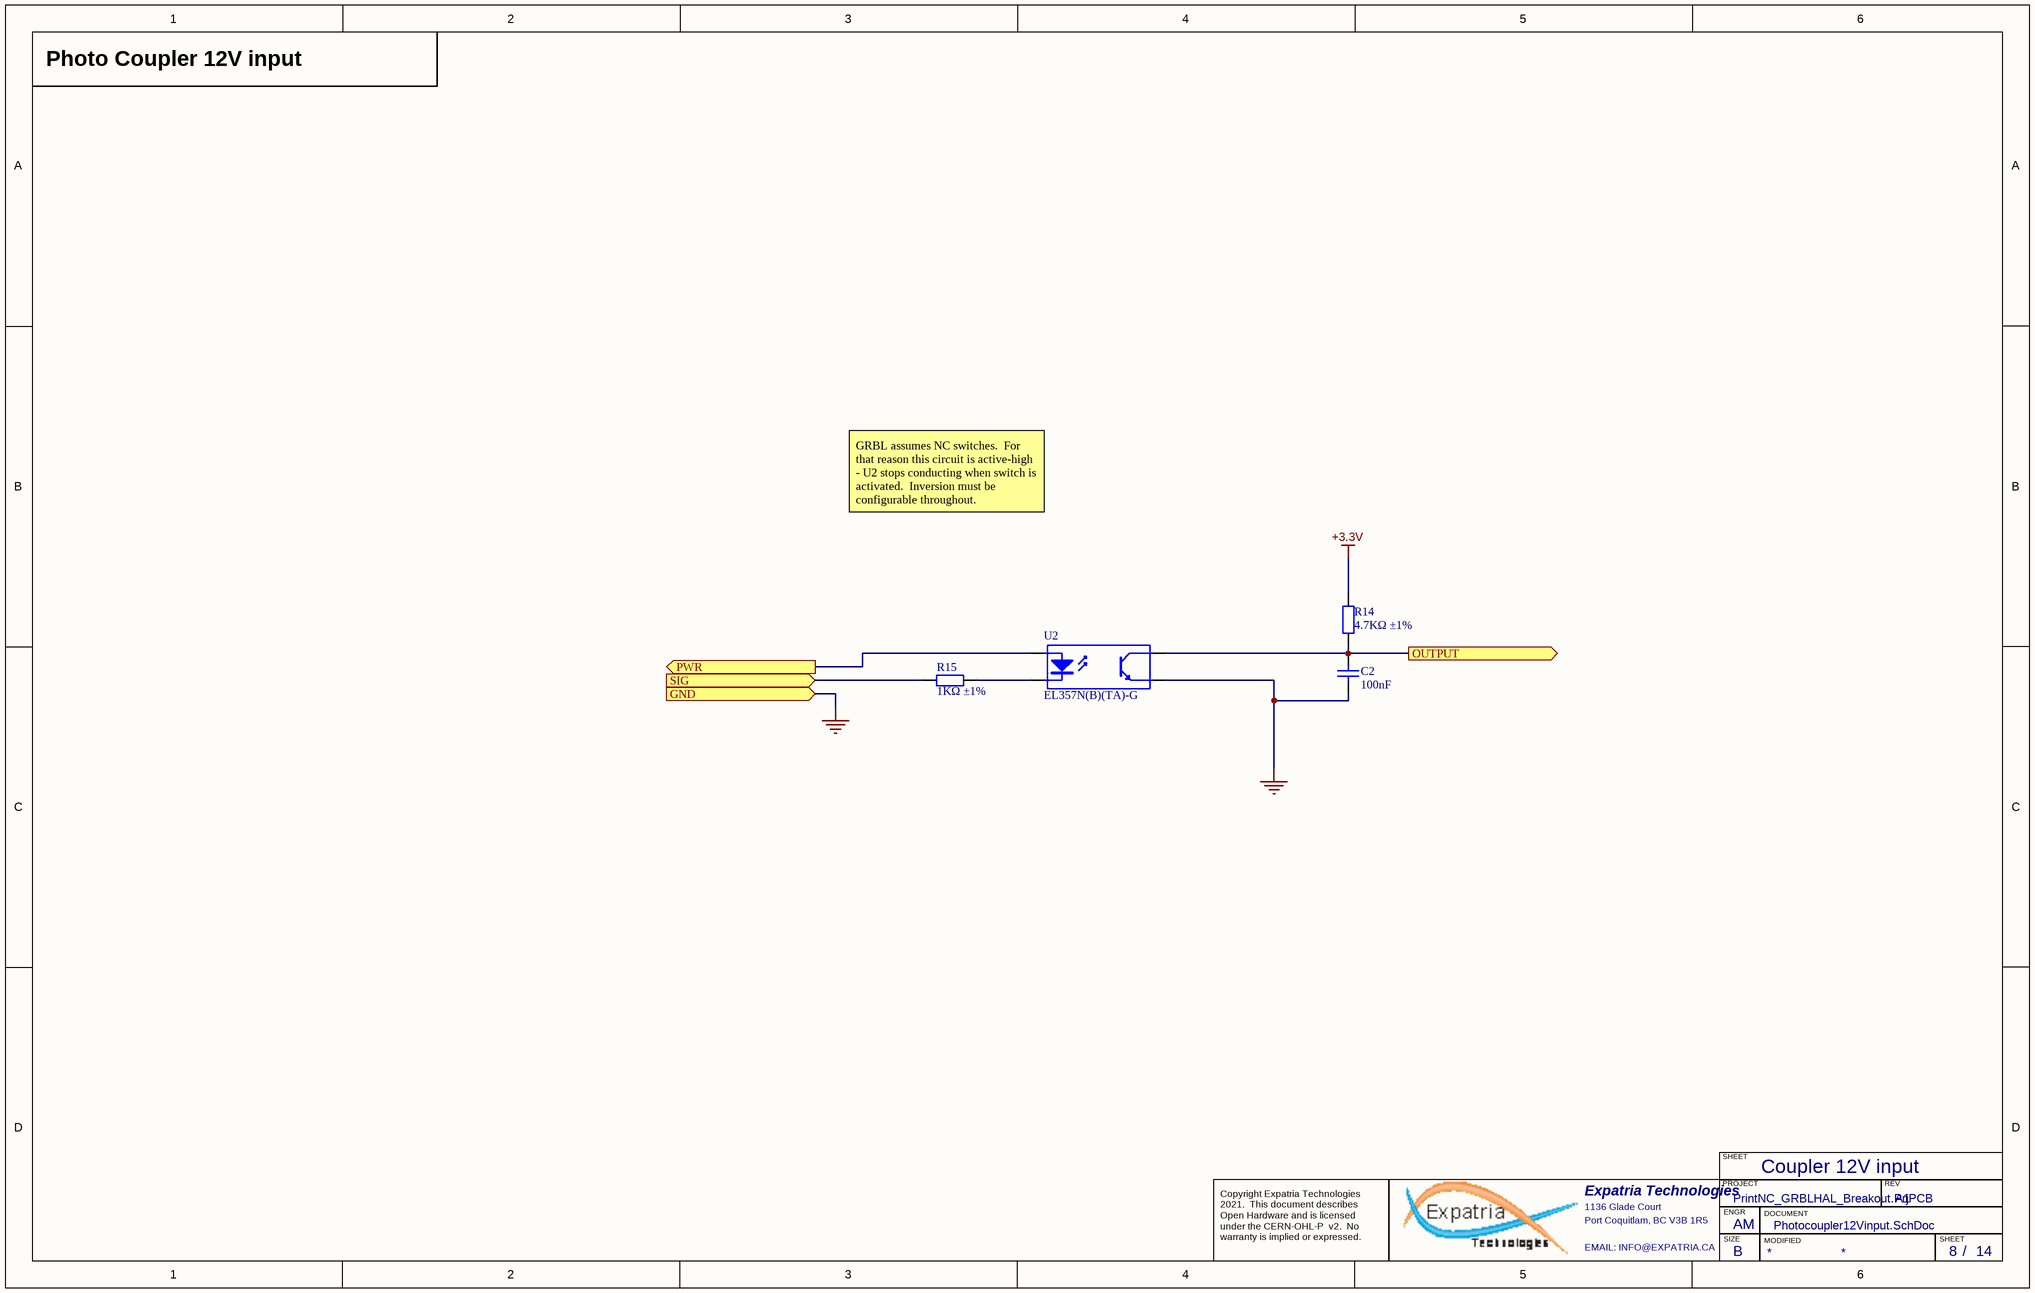
[diagram p9: Photocoupler12Vinput.SchDoc]

### Parts
C2  100nF  [0402_C]
R14  4.7KΩ ±1%  [0402_R]
R15  1KΩ ±1%  [0402_R]
U2  EL357N(B)(TA)-G  [SOP-4_P2.54]

### Ports
GND (in), OUTPUT (out), PWR (out), SIG (in)

### Nets
+3.3V: R14.2
GND: C2.1 U2.3(E) ; port GND
OUTPUT: C2.2 R14.1 U2.4(C) ; port OUTPUT
PWR: U2.1(A) ; port PWR
SIG: R15.1 ; port SIG
NetR15_2: R15.2 U2.2(K)

### Channels
U_PrintNC_BREAKOUT/USR_SW/PH_DR: designators end in _PH_DR; ports GND=GND OUTPUT=DOOR PWR=+12V SIG=DOOR_out
U_PrintNC_BREAKOUT/USR_SW/PH_CY: designators end in _PH_CY; ports GND=GND OUTPUT=CYC/ST PWR=+12V SIG=CYC/ST_out
U_PrintNC_BREAKOUT/USR_SW/PH_FD: designators end in _PH_FD; ports GND=GND OUTPUT=FD/HLD PWR=+12V SIG=HOLD_out
U_PrintNC_BREAKOUT/USR_SW/PH_HLT: designators end in _PH_HLT; ports GND=GND OUTPUT=HALT PWR=+12V SIG=HALT_out

### Notes on the sheet
- Photo Coupler 12V input
- GRBL assumes NC switches.  For that reason this circuit is active-high - U2 stops conducting when switch is activated.  Inversion must be configurable throughout.
- Coupler 12V input
- SHEET
- Expatria Technologies
- 1136 Glade Court
- Port Coquitlam, BC V3B 1R5
- PROJECT
- SIZE
- ENGR
- MODIFIED
- DOCUMENT
- REV
- Copyright Expatria Technologies 2021.  This document describes Open Hardware and is licensed under the CERN-OHL-P  v2.  No warranty is implied or expressed.
- EMAIL: INFO@EXPATRIA.CA
- B
- /

### Library data of the parts
C2 = 0402 100nF (104) 10% 16V: as C13 on sheet PrintNC_CNC_Breakout; Package: 0402; Supplier: LC; SuppliersPartNumber: C1525; Capacitance: 100nF
R14 = 0402 4.7K (4701) 1%: as R47 on sheet PrintNC_CNC_Breakout; Package: 0402; Supplier: LC; SuppliersPartNumber: C25900; Resistance: 4.7KΩ; Tolerance: 1%
R15 = 0402 1K (1001) 1%: Chip resistor; Manufacturer: Uniroyal Elec; PartNumber: 0402WGF1001TCE; Power: 1/16W; Package: 0402; Supplier: LC; SuppliersPartNumber: C11702; Resistance: 1KΩ; Tolerance: 1%
U2 = EL357N(B)(TA)-G_[C6649]: 贴片光耦; Package: SOP-4_P2.54; Supplier: LC; SuppliersPartNumber: C6649

## Sheet Stepper_driver.SchDoc: GRBLHAL_2000_EST
size B; Author: AM; CompanyName: Expatria Technologies; DrawnBy: A.Marles; Engineer: AM; Organization: Expatria Technologies; DocumentNumber: 9; Revision: A1; SheetNumber: 9; SheetTotal: 14; PCB_Rev: A1
Used 5 times, as channels U_PrintNC_BREAKOUT/STP_X, U_PrintNC_BREAKOUT/STP_Y, U_PrintNC_BREAKOUT/STP_Z, U_PrintNC_BREAKOUT/STP_A, U_PrintNC_BREAKOUT/STP_B. Parts and nets are listed once, with the designators drawn on the sheet.
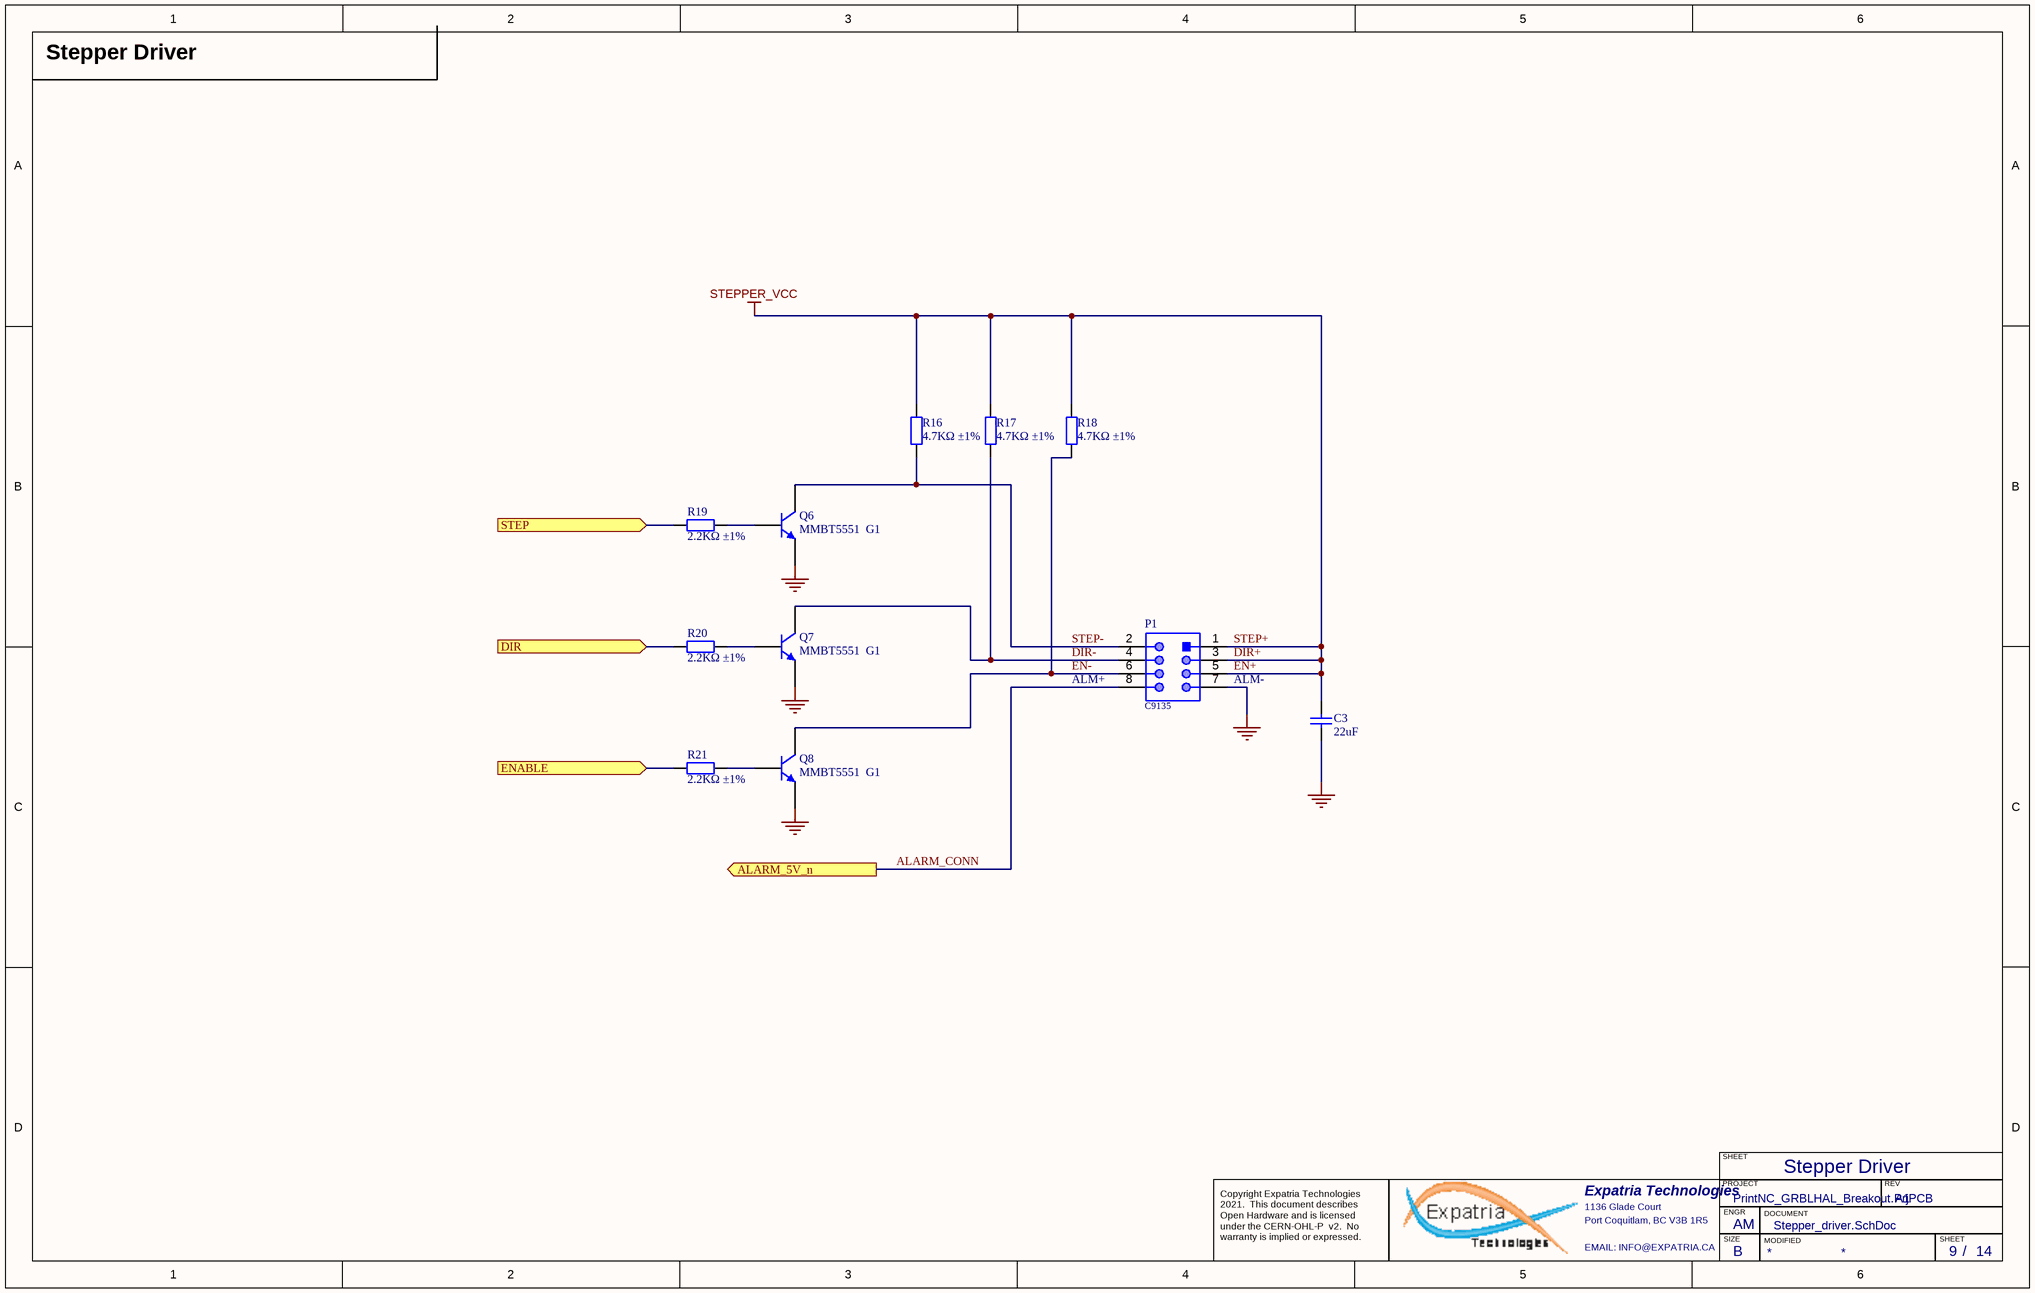
[diagram p10: Stepper_driver.SchDoc]

### Parts
C3  22uF  [0805_C]
P1  C9135  [61200821621]
Q6  MMBT5551  G1  [SOT-23(SOT-23-3)]
Q7  MMBT5551  G1  [SOT-23(SOT-23-3)]
Q8  MMBT5551  G1  [SOT-23(SOT-23-3)]
R16  4.7KΩ ±1%  [0402_R]
R17  4.7KΩ ±1%  [0402_R]
R18  4.7KΩ ±1%  [0402_R]
R19  2.2KΩ ±1%  [0402_R]
R20  2.2KΩ ±1%  [0402_R]
R21  2.2KΩ ±1%  [0402_R]

### Ports
ALARM_5V_n (out), DIR (in), ENABLE (in), STEP (in)

### Nets
GND: C3.1 P1.7 Q6.2(E) Q7.2(E) Q8.2(E)
STEPPER_VCC: C3.2 P1.1 P1.3 P1.5 R16.2 R17.2 R18.2  [also labelled DIR+, EN+, STEP+]
ALARM_CONN: P1.8 ; port ALARM_5V_n
DIR: R20.1 ; port DIR
DIR-: P1.4 Q7.3(C) R17.1
EN-: P1.6 Q8.3(C) R18.1
ENABLE: R21.1 ; port ENABLE
STEP: R19.1 ; port STEP
STEP-: P1.2 Q6.3(C) R16.1
NetQ6_1: Q6.1(B) R19.2
NetQ7_1: Q7.1(B) R20.2
NetQ8_1: Q8.1(B) R21.2

### Channels
U_PrintNC_BREAKOUT/STP_X: designators end in _STP_X; ports ALARM_5V_n=STP_ALARM_5V_n DIR=DIR_X ENABLE=STP_EN STEP=STEP_X
U_PrintNC_BREAKOUT/STP_Y: designators end in _STP_Y; ports ALARM_5V_n=STP_ALARM_5V_n DIR=DIR_Y ENABLE=STP_EN STEP=STEP_Y
U_PrintNC_BREAKOUT/STP_Z: designators end in _STP_Z; ports ALARM_5V_n=STP_ALARM_5V_n DIR=DIR_Z ENABLE=STP_EN_Z STEP=STEP_Z
U_PrintNC_BREAKOUT/STP_A: designators end in _STP_A; ports ALARM_5V_n=STP_ALARM_5V_n DIR=DIR_A ENABLE=STP_EN STEP=STEP_A
U_PrintNC_BREAKOUT/STP_B: designators end in _STP_B; ports ALARM_5V_n=STP_ALARM_5V_n DIR=DIR_B ENABLE=STP_EN STEP=STEP_B

### Notes on the sheet
- Stepper Driver
- (near P1) ALM+
- (near P1) ALM-
- SHEET
- Expatria Technologies
- 1136 Glade Court
- Port Coquitlam, BC V3B 1R5
- PROJECT
- SIZE
- ENGR
- MODIFIED
- DOCUMENT
- REV
- Copyright Expatria Technologies 2021.  This document describes Open Hardware and is licensed under the CERN-OHL-P  v2.  No warranty is implied or expressed.
- EMAIL: INFO@EXPATRIA.CA
- B
- /

### Library data of the parts
C3 = 0805 22uF (226) 20% 25V: as C11 on sheet PrintNC_CNC_Breakout; Package: 0805; Supplier: LC; SuppliersPartNumber: C45783; Capacitance: 22uF
P1 = CMP-1502-00006-1: as P6 on sheet PrintNC_CNC_Breakout; Publisher: WurthElektronik; Part Number: C9135; Packaging: Tray; Published Date: August2018; Package Reference: 61200821621; SuppliersPartNumber: C9135
Q6-Q8 = SOT-23 MMBT5551  G1: 三极管; Package: SOT-23; Supplier: LC; SuppliersPartNumber: C2145
R16-R18 = 0402 4.7K (4701) 1%: as R47 on sheet PrintNC_CNC_Breakout; Package: 0402; Supplier: LC; SuppliersPartNumber: C25900; Resistance: 4.7KΩ; Tolerance: 1%
R19-R21 = 0402 2.2K (2201) 1%: Chip resistor; Manufacturer: Uniroyal Elec; PartNumber: 0402WGF2201TCE; Power: 1/16W; Package: 0402; Supplier: LC; SuppliersPartNumber: C25879; Resistance: 2.2KΩ; Tolerance: 1%

## Sheet Spindle_Control.SchDoc: GRBLHAL_2000_EST
size B; Author: AM; CompanyName: Expatria Technologies; DrawnBy: A.Marles; Engineer: AM; Organization: Expatria Technologies; DocumentNumber: 10; Revision: A1; SheetNumber: 10; SheetTotal: 14; PCB_Rev: A1
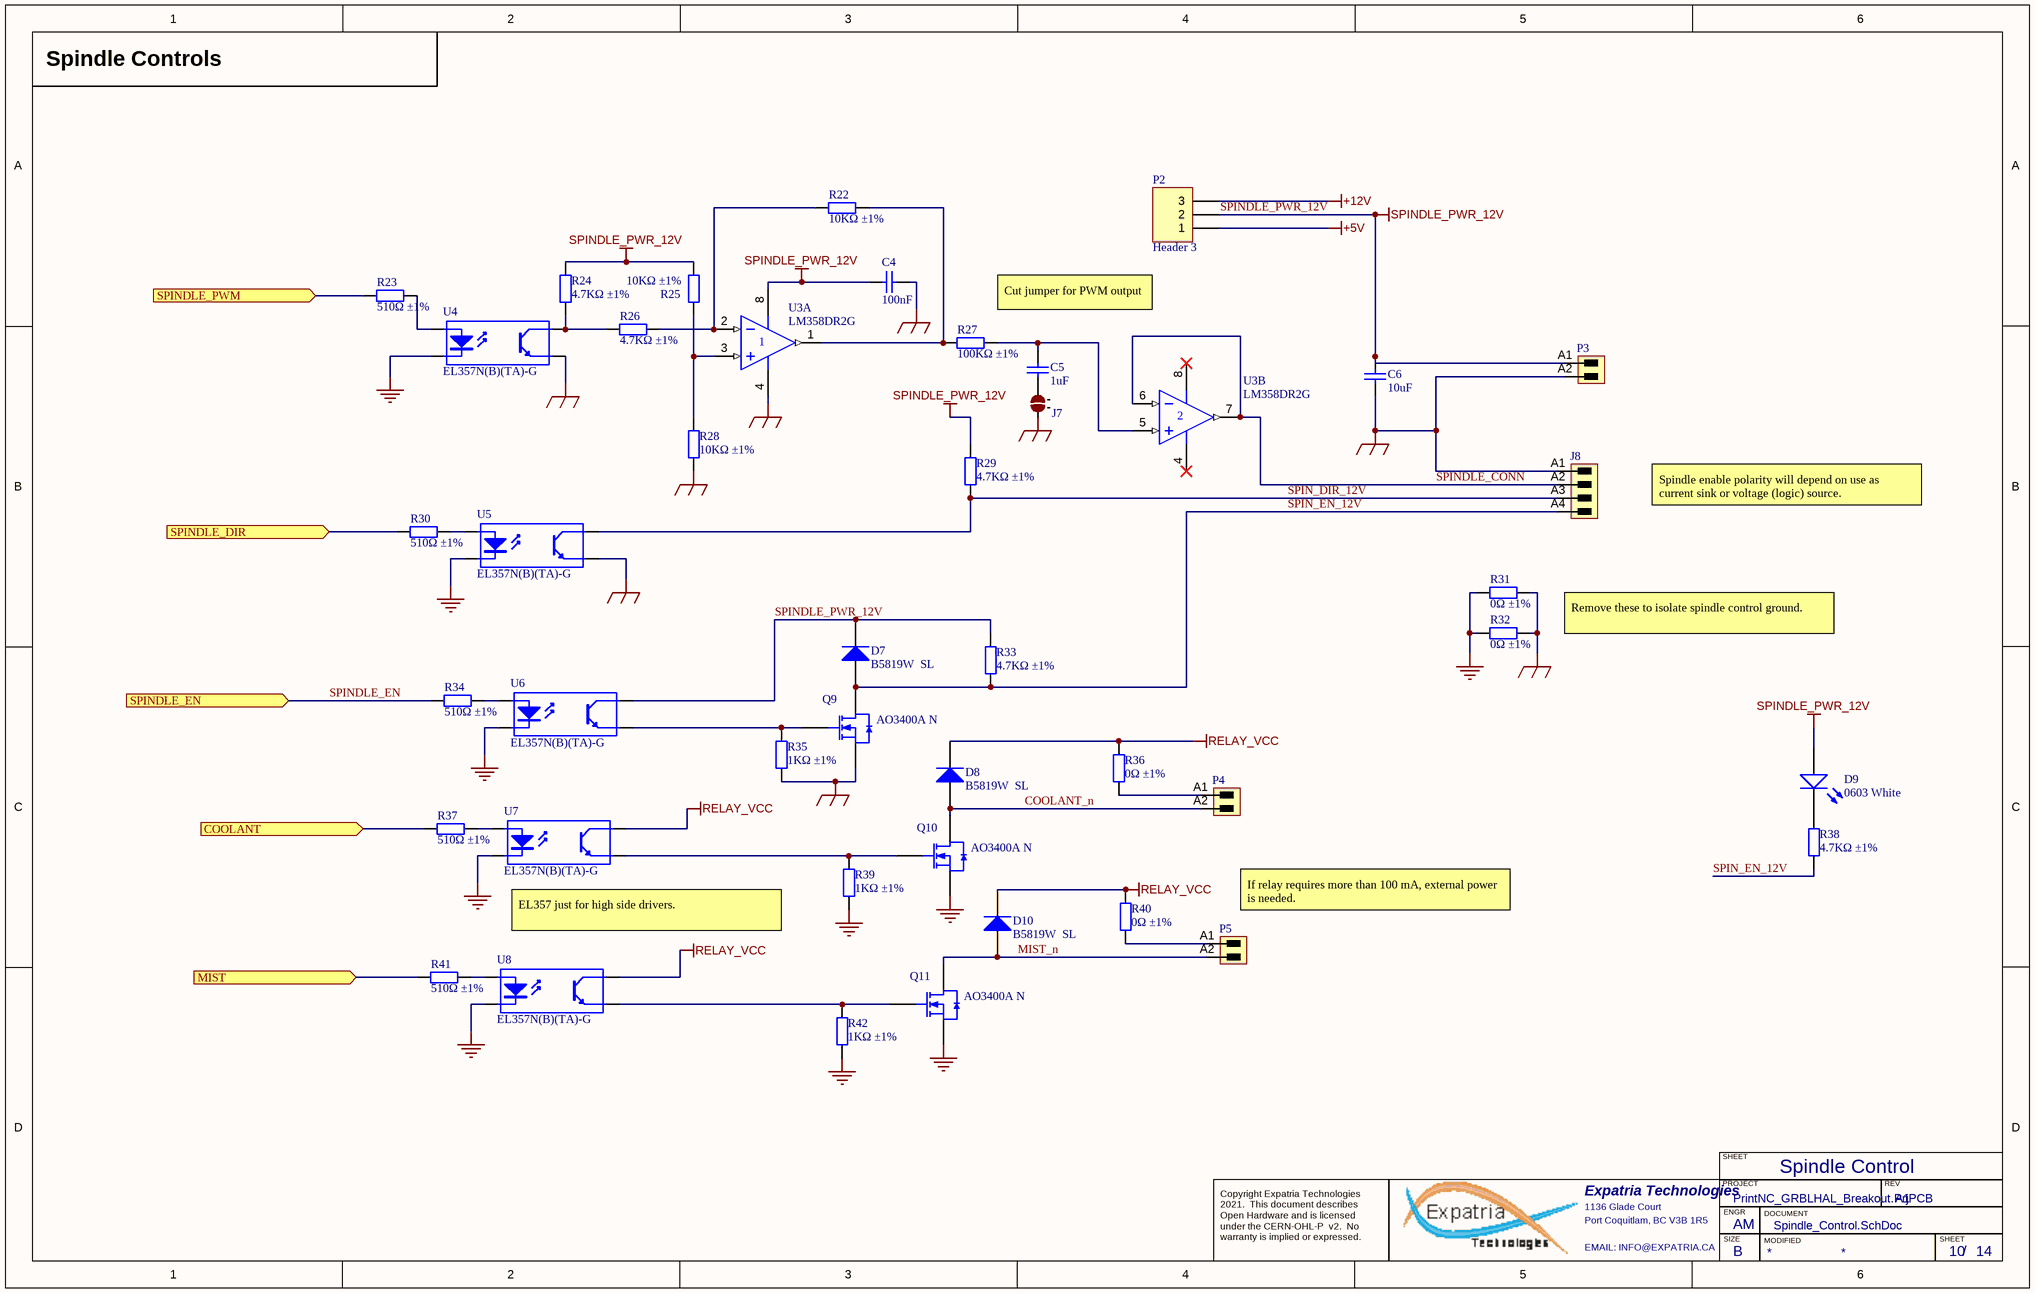
[diagram p11: Spindle_Control.SchDoc]

### Parts
C4  100nF  [0603_C]
C5  1uF  [0603_C]
C6  10uF  [1206_C]
D7  B5819W  SL  [SOD-123]
D8  B5819W  SL  [SOD-123]
D9  0603 White  [0603_LED_S1]
D10  B5819W  SL  [SOD-123]
J7  2 way net solder junction - Normally Open  [2waySolder_NO]  (value not drawn)  (no BOM)
J8  (no value)  [SL_SMT_3_5_180G_04]
P2  Header 3  [HDR1X3]
P3  (no value)  [SL_3_50_180G_02]
P4  (no value)  [SL_3_50_180G_02]
P5  (no value)  [SL_3_50_180G_02]
Q9  AO3400A N  [SOT-23-3L]
Q10  AO3400A N  [SOT-23-3L]
Q11  AO3400A N  [SOT-23-3L]
R22  10KΩ ±1%  [0402_R]
R23  510Ω ±1%  [0402_R]
R24  4.7KΩ ±1%  [0402_R]
R25  10KΩ ±1%  [0402_R]
R26  4.7KΩ ±1%  [0402_R]
R27  100KΩ ±1%  [0402_R]
R28  10KΩ ±1%  [0402_R]
R29  4.7KΩ ±1%  [0402_R]
R30  510Ω ±1%  [0402_R]
R31  0Ω ±1%  [0402_R]
R32  0Ω ±1%  [0402_R]
R33  4.7KΩ ±1%  [0402_R]
R34  510Ω ±1%  [0402_R]
R35  1KΩ ±1%  [0402_R]
R36  0Ω ±1%  [0402_R]
R37  510Ω ±1%  [0402_R]
R38  4.7KΩ ±1%  [0402_R]
R39  1KΩ ±1%  [0402_R]
R40  0Ω ±1%  [0402_R]
R41  510Ω ±1%  [0402_R]
R42  1KΩ ±1%  [0402_R]
U3  LM358DR2G  [SOIC-8_150mil]  (parts A,B of 2)
U4  EL357N(B)(TA)-G  [SOP-4_P2.54]
U5  EL357N(B)(TA)-G  [SOP-4_P2.54]
U6  EL357N(B)(TA)-G  [SOP-4_P2.54]
U7  EL357N(B)(TA)-G  [SOP-4_P2.54]
U8  EL357N(B)(TA)-G  [SOP-4_P2.54]

### Ports
COOLANT (in), MIST (in), SPINDLE_DIR (in), SPINDLE_EN (in), SPINDLE_PWM (in)

### Nets
+5V: P2.1
+12V: P2.3
GND: Q10.2(S) Q11.2(S) R31.1 R32.1 R39.1 R42.1 U4.2(K) U5.2(K) U6.2(K) U7.2(K) U8.2(K)
RELAY_VCC: D8.2(K) D10.2(K) R36.1 R40.1 U7.4(C) U8.4(C)
SPIN_GND: C4.1 C6.1 J7.1 J8.A1 P3.A2 Q9.2(S) R28.2 R31.2 R32.2 R35.2 U3.4(V-) U4.3(E) U5.3(E)
SPINDLE_PWR_12V: C4.2 C6.2 D7.2(K) D9.A P2.2 P3.A1 R24.1 R25.1 R29.2 R33.2 U3.8(V+) U6.4(C)
COOLANT: R37.1 ; port COOLANT
COOLANT_n: D8.1(A) P4.A2 Q10.3(D)
MIST: R41.1 ; port MIST
MIST_n: D10.1(A) P5.A2 Q11.3(D)
SPIN_DIR_12V: J8.A3 R29.1 U5.4(C)
SPIN_EN_12V: D7.1(A) J8.A4 Q9.3(D) R33.1 R38.1
SPINDLE_CONN: J8.A2 U3.6(IN-) U3.7(OUT)
SPINDLE_DIR: R30.1 ; port SPINDLE_DIR
SPINDLE_EN: R34.1 ; port SPINDLE_EN
SPINDLE_PWM: R23.1 ; port SPINDLE_PWM
NetC5_1: C5.1 J7.2
NetC5_2: C5.2 R27.1 U3.5(IN+)
NetD9_K: D9.K R38.2
NetP4_A1: P4.A1 R36.2
NetP5_A1: P5.A1 R40.2
NetQ9_1: Q9.1(G) R35.1 U6.3(E)
NetQ10_1: Q10.1(G) R39.2 U7.3(E)
NetQ11_1: Q11.1(G) R42.2 U8.3(E)
NetR22_1: R22.1 R26.2 U3.2(IN-)
NetR22_2: R22.2 R27.2 U3.1(OUT)
NetR23_2: R23.2 U4.1(A)
NetR24_2: R24.2 R26.1 U4.4(C)
NetR25_2: R25.2 R28.1 U3.3(IN+)
NetR30_2: R30.2 U5.1(A)
NetR34_2: R34.2 U6.1(A)
NetR37_2: R37.2 U7.1(A)
NetR41_2: R41.2 U8.1(A)

### Notes on the sheet
- Spindle Controls
- Cut jumper for PWM output
- Spindle enable polarity will depend on use as current sink or voltage (logic) source.
- Remove these to isolate spindle control ground.
- (near P5) If relay requires more than 100 mA, external power is needed.
- EL357 just for high side drivers.
- Spindle Control
- SHEET
- Expatria Technologies
- 1136 Glade Court
- Port Coquitlam, BC V3B 1R5
- PROJECT
- SIZE
- ENGR
- MODIFIED
- DOCUMENT
- REV
- Copyright Expatria Technologies 2021.  This document describes Open Hardware and is licensed under the CERN-OHL-P  v2.  No warranty is implied or expressed.
- EMAIL: INFO@EXPATRIA.CA
- B
- /

### Library data of the parts
C4 = 0603 100nF (104) 10% 50V: as C8 on sheet PrintNC_CNC_Breakout; Package: 0603; Supplier: LC; SuppliersPartNumber: C14663; Capacitance: 100nF
C5 = 0603 1uF (105) 10% 50V: Chip capacitors; Manufacturer: Samsung Electro-Mechanics; PartNumber: CL10A105KB8NNNC; Tolerance: 10%; Voltage: 50V; Package: 0603; Supplier: LC; SuppliersPartNumber: C15849; Capacitance: 1uF
C6 = 1206 10uF (106) 10% 50V: as C9 on sheet PrintNC_CNC_Breakout; Package: 1206; Supplier: LC; SuppliersPartNumber: C13585; Capacitance: 10uF
D7 D8 D10 = SOD-123 B5819W  SL: Schottky Diode; Package: SOD-123; Supplier: LC; SuppliersPartNumber: C8598
D9 = 0603 LED White: LED; Package: 0603; Supplier: LC; SuppliersPartNumber: C2290; Color: White
J7 = 2waySolderNO
J8 = CMP-1559-01140-1: OMNIMATE Signal - series BL/SL 3.50; PartNumber: 1751264; Manufacturer: Phoenix Contact; Side_termination_characteristic: closed side; Pitch_mm: 3.5 mm; Pitch_inch: 0.138 inch; Short_text_for_material: SL-SMT 3.50/04/180G 3.2SN BK BX; UL_94_flammability_rating: V-0; Solder_pin_length_mm: 3.2 mm; Revision: V1; Packaging: Box; PackageReference: SL_SMT_3_5_180G_04; SuppliersPartNumber: C99845
P2 = Header 3: Header, 3-Pin; Publisher: Altium Limited; SuppliersPartNumber: C49257
P3-P5 = CMP-1559-00901-1: as P8 on sheet PrintNC_CNC_Breakout; Revision: V1; PackageReference: SL_3_50_180G_02; Packaging: Box; SuppliersPartNumber: C192777
Q9-Q11 = AO3400A N道沟 X0YV1T SOT-23: MOS(场效应管); Package: SOT-23; Supplier: LC; SuppliersPartNumber: C20917
R22 R25 R28 = 0402 10K (1002) 1%: as R45 on sheet PrintNC_CNC_Breakout; Package: 0402; Supplier: LC; SuppliersPartNumber: C25744; Resistance: 10KΩ; Tolerance: 1%
R23 R30 R34 R37 R41 = 0402 510R (5100) 1%: as R54 on sheet PrintNC_CNC_Breakout; Package: 0402; Supplier: LC; SuppliersPartNumber: C25123; Resistance: 510Ω; Tolerance: 1%
R24 R26 R29 R33 R38 = 0402 4.7K (4701) 1%: as R47 on sheet PrintNC_CNC_Breakout; Package: 0402; Supplier: LC; SuppliersPartNumber: C25900; Resistance: 4.7KΩ; Tolerance: 1%
R27 = 0402 100K (1003) 1%: as R53 on sheet PrintNC_CNC_Breakout; Package: 0402; Supplier: LC; SuppliersPartNumber: C25741; Resistance: 100KΩ; Tolerance: 1%
R31 R32 R36 R40 = 0402 0R (0R0) 1%: as L1 on sheet PrintNC_CNC_Breakout; Package: 0402; Supplier: LC; SuppliersPartNumber: C17168; Resistance: 0Ω; Tolerance: 1%
R35 R39 R42 = 0402 1K (1001) 1%: as R15 on sheet Photocoupler12Vinput; Package: 0402; Supplier: LC; SuppliersPartNumber: C11702; Resistance: 1KΩ; Tolerance: 1%; ComponentLink1Description: Supplier link; ComponentLink1URL: http://www.szlcsc.com/product/details_12256.html
U3 = LM358DR2G_[C7950]: LM358DR2G,  Dual Op Amp,  5 - 28 V,  8-PinSOIC; Manufacturer 1: ON Semiconductor; Package: SOIC-8; Supplier: LC; SuppliersPartNumber: C7950; Manufacturer Part Number 1: LM358DR2G; Packaging: Tape and Reel; Length: 5mm
U4-U8 = EL357N(B)(TA)-G_[C6649]: Optocoupler SOP-4, EL357N(B)(TA)-G, Everlight Electronics; Package: SOP-4_P2.54; Supplier: LC; SuppliersPartNumber: C6649; Manufacturer 1: Everlight; Manufacturer Part Number 1: EL357N(B)(TA)-G